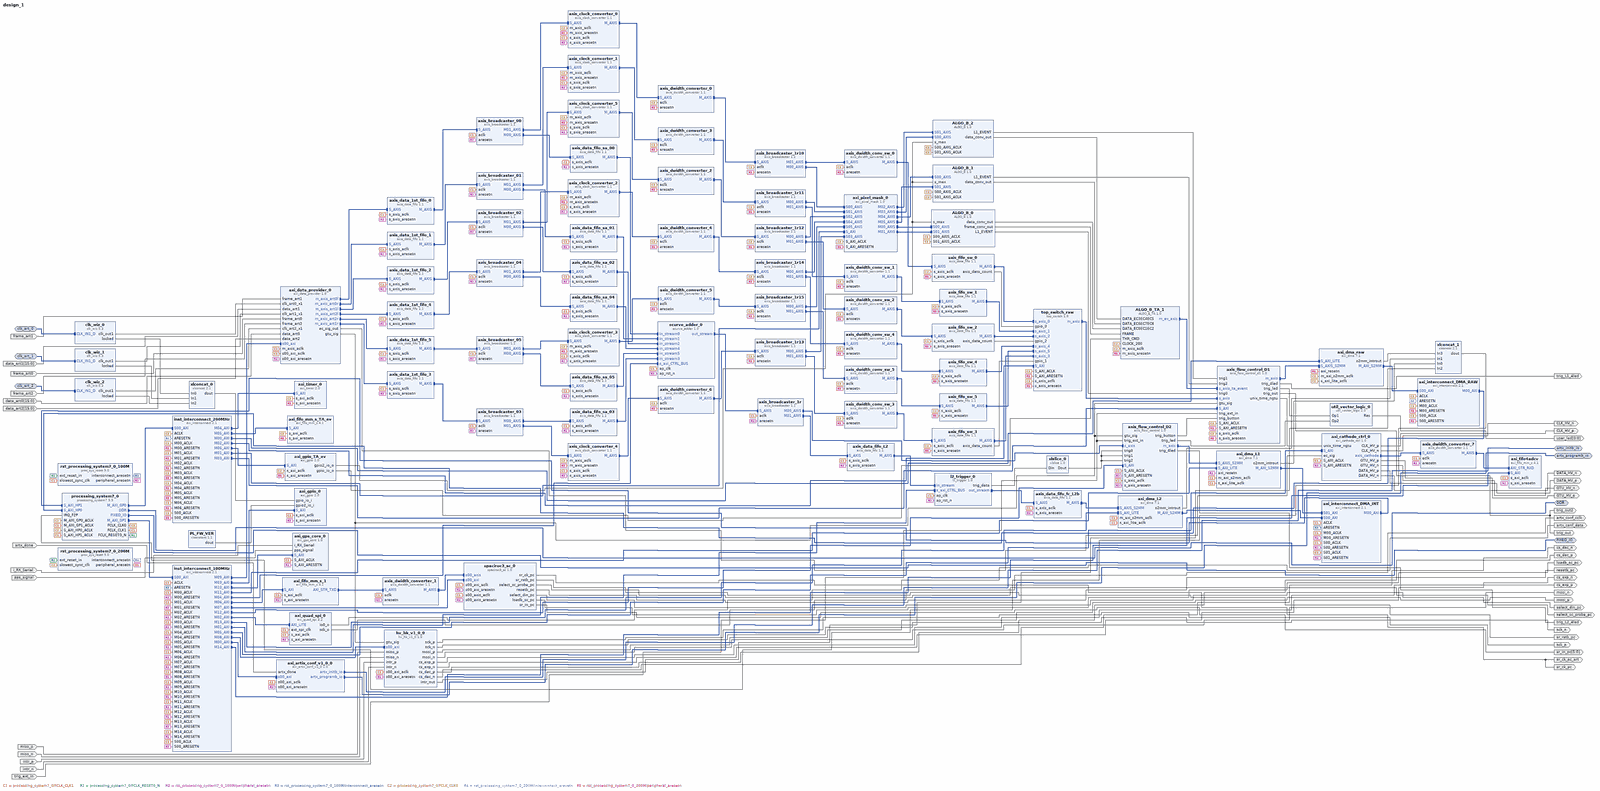
[diagram p0: block diagram of the top level, whole]
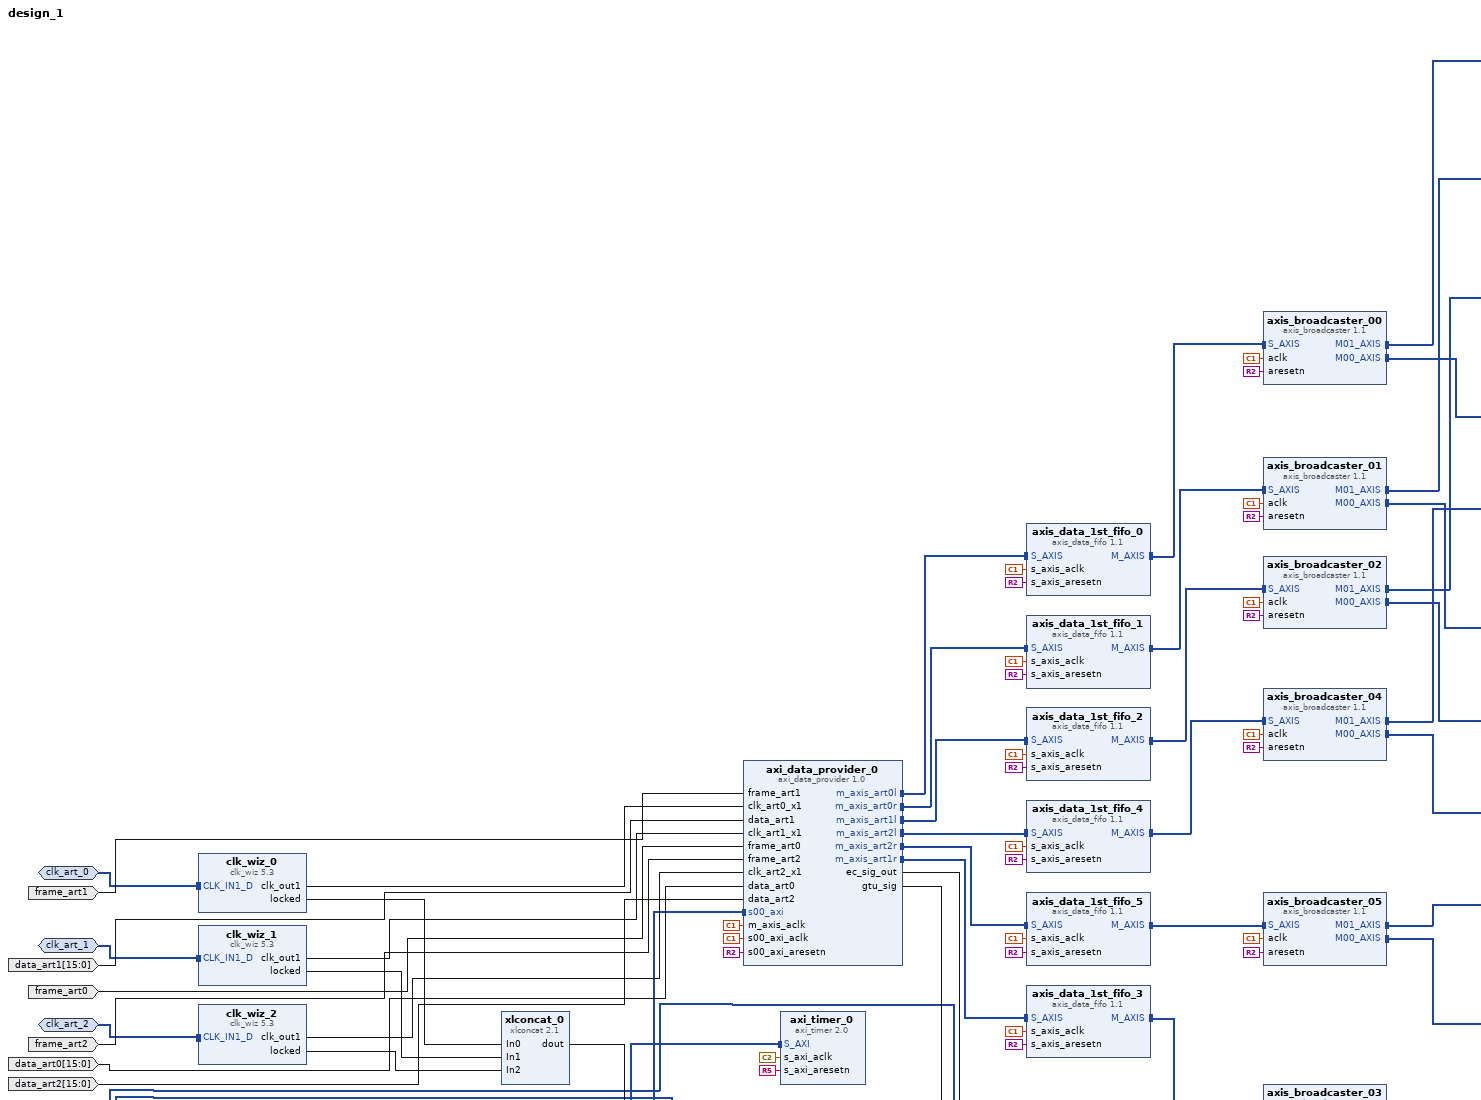
[diagram p1: block diagram of the top level, upper left part]
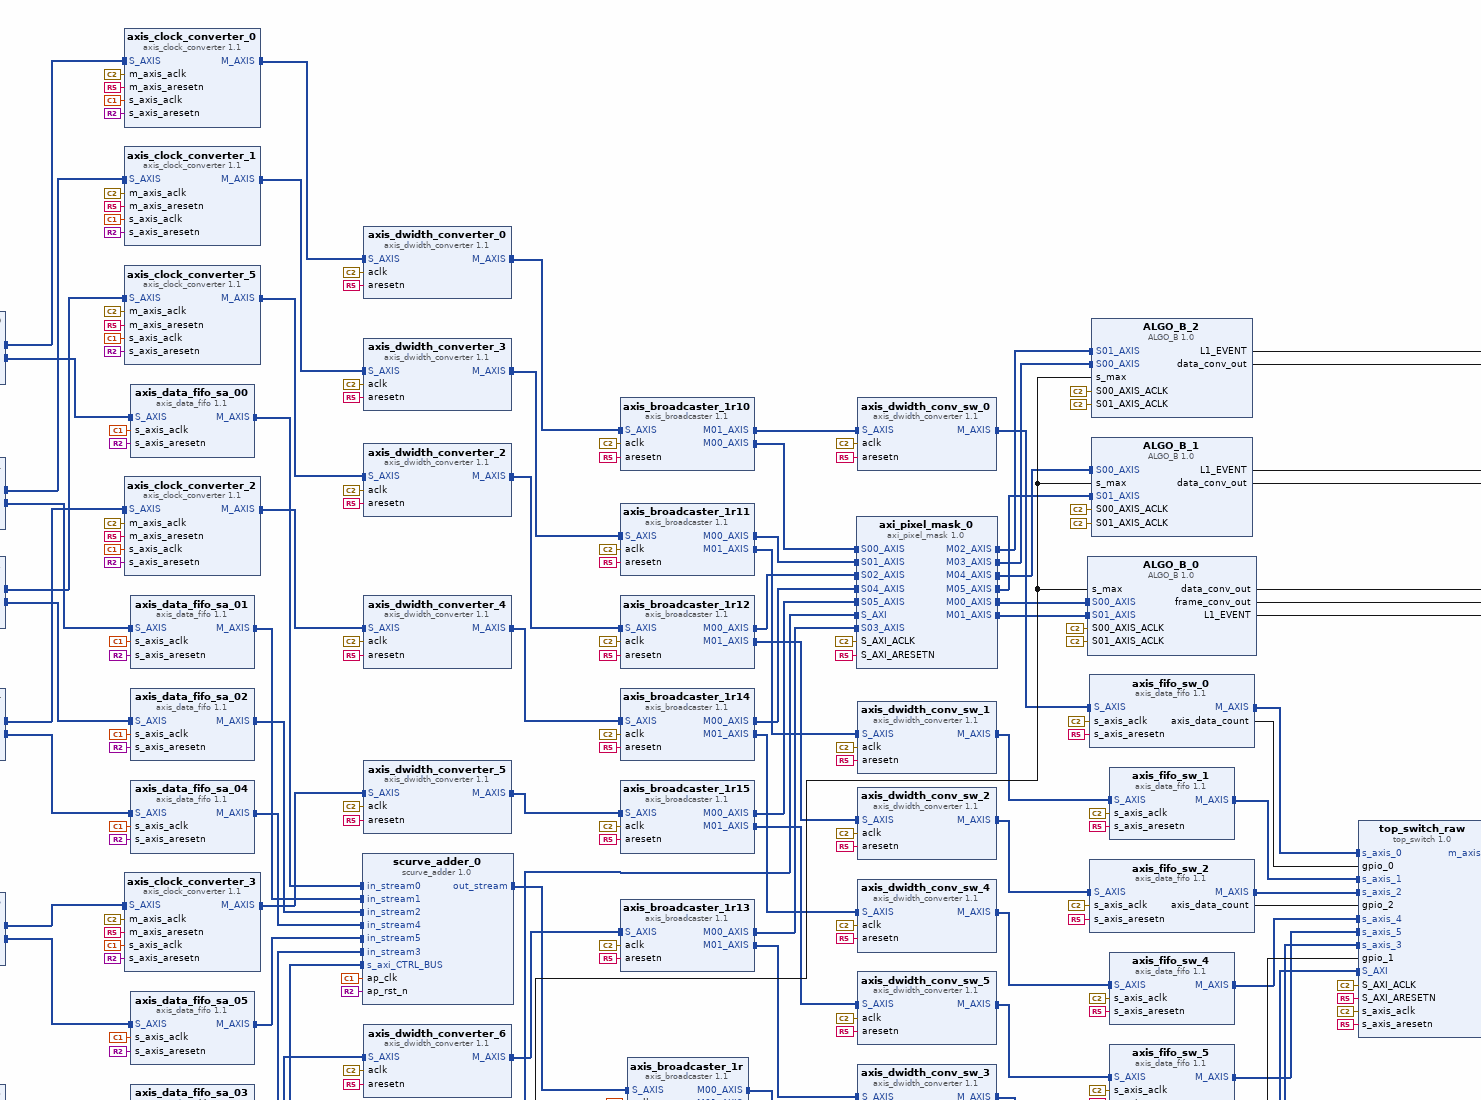
[diagram p2: block diagram of the top level, upper centre part]
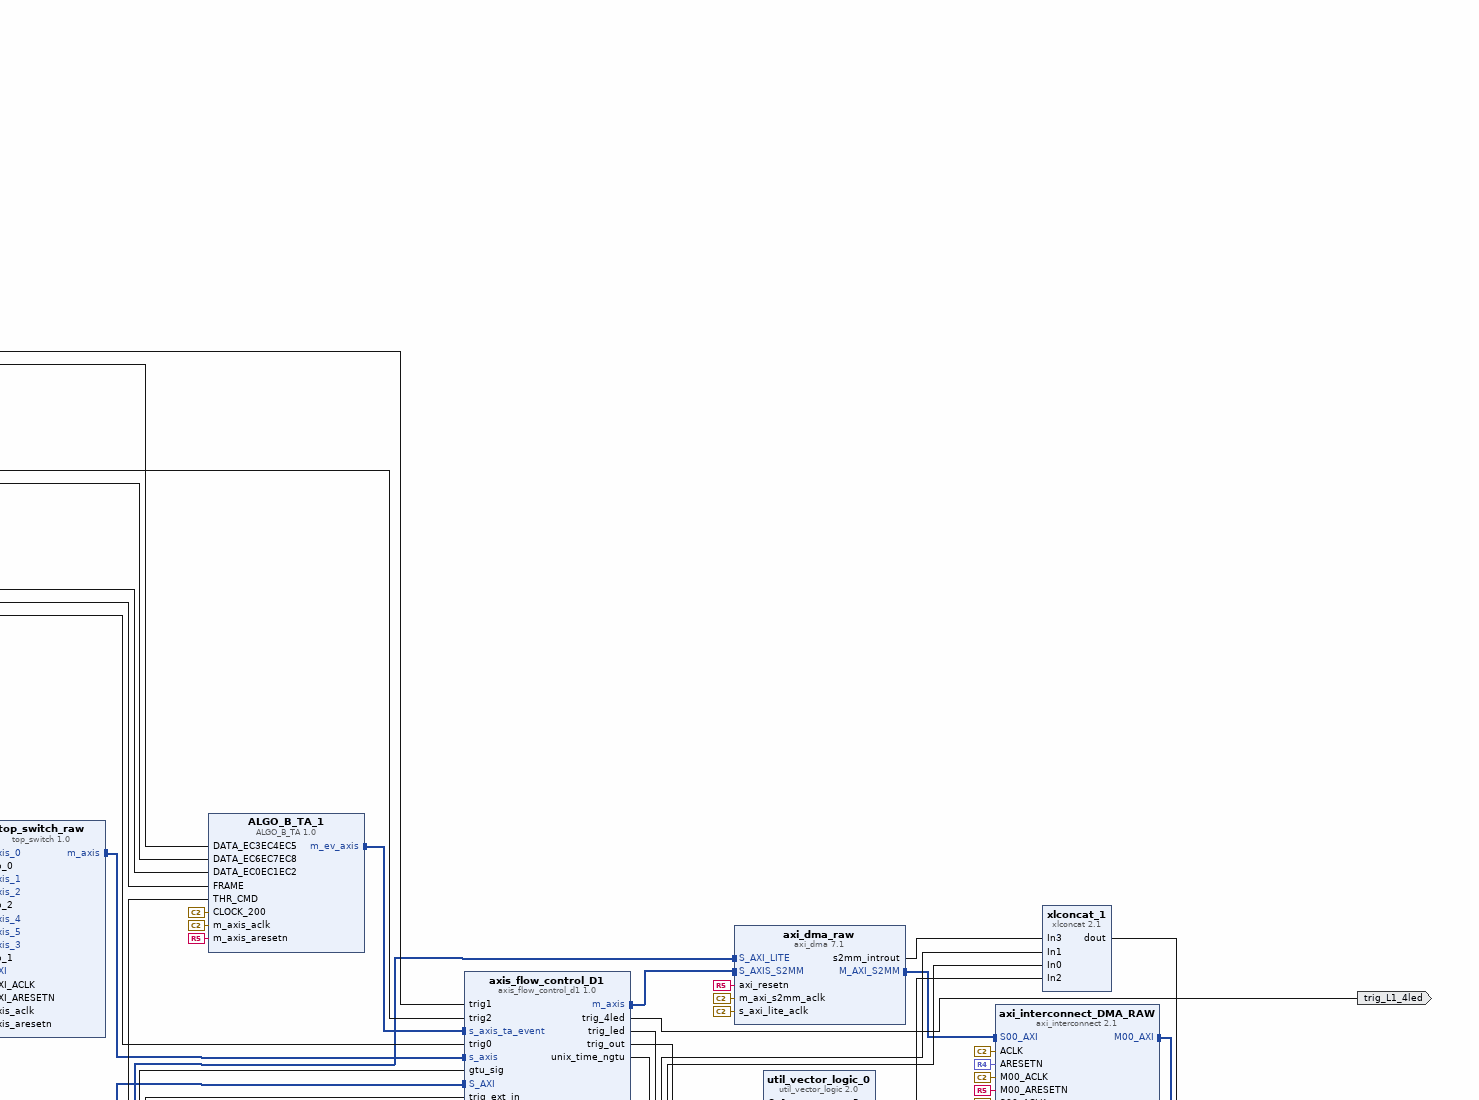
[diagram p3: block diagram of the top level, upper right part]
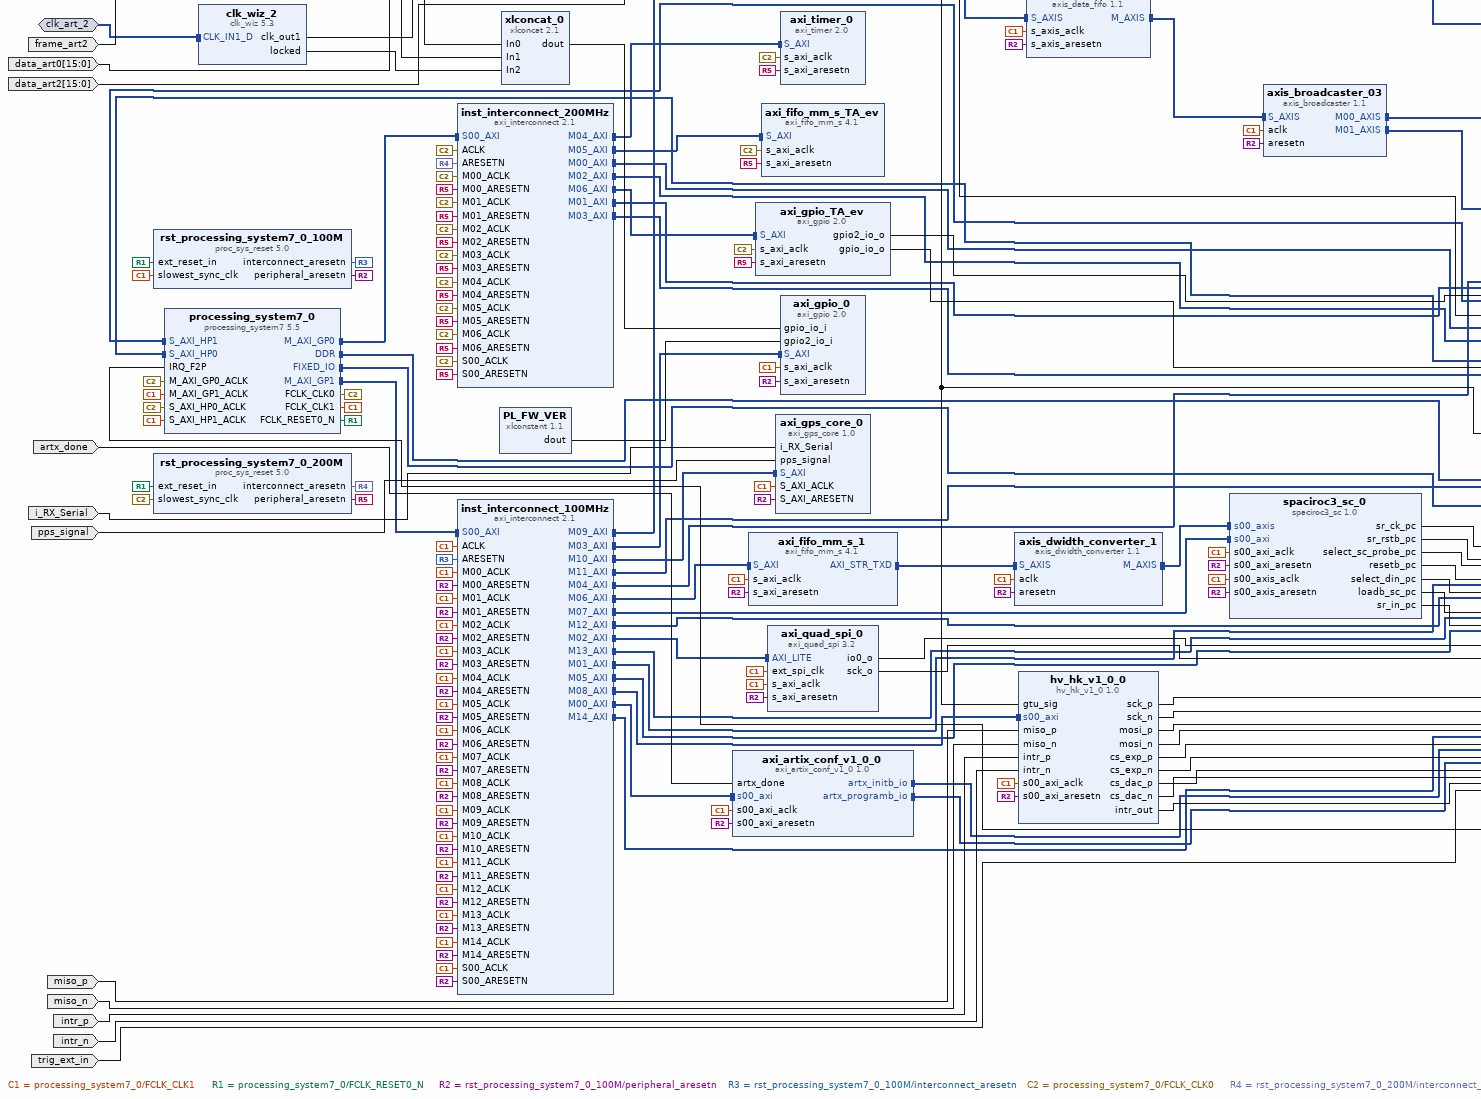
[diagram p4: block diagram of the top level, lower left part]
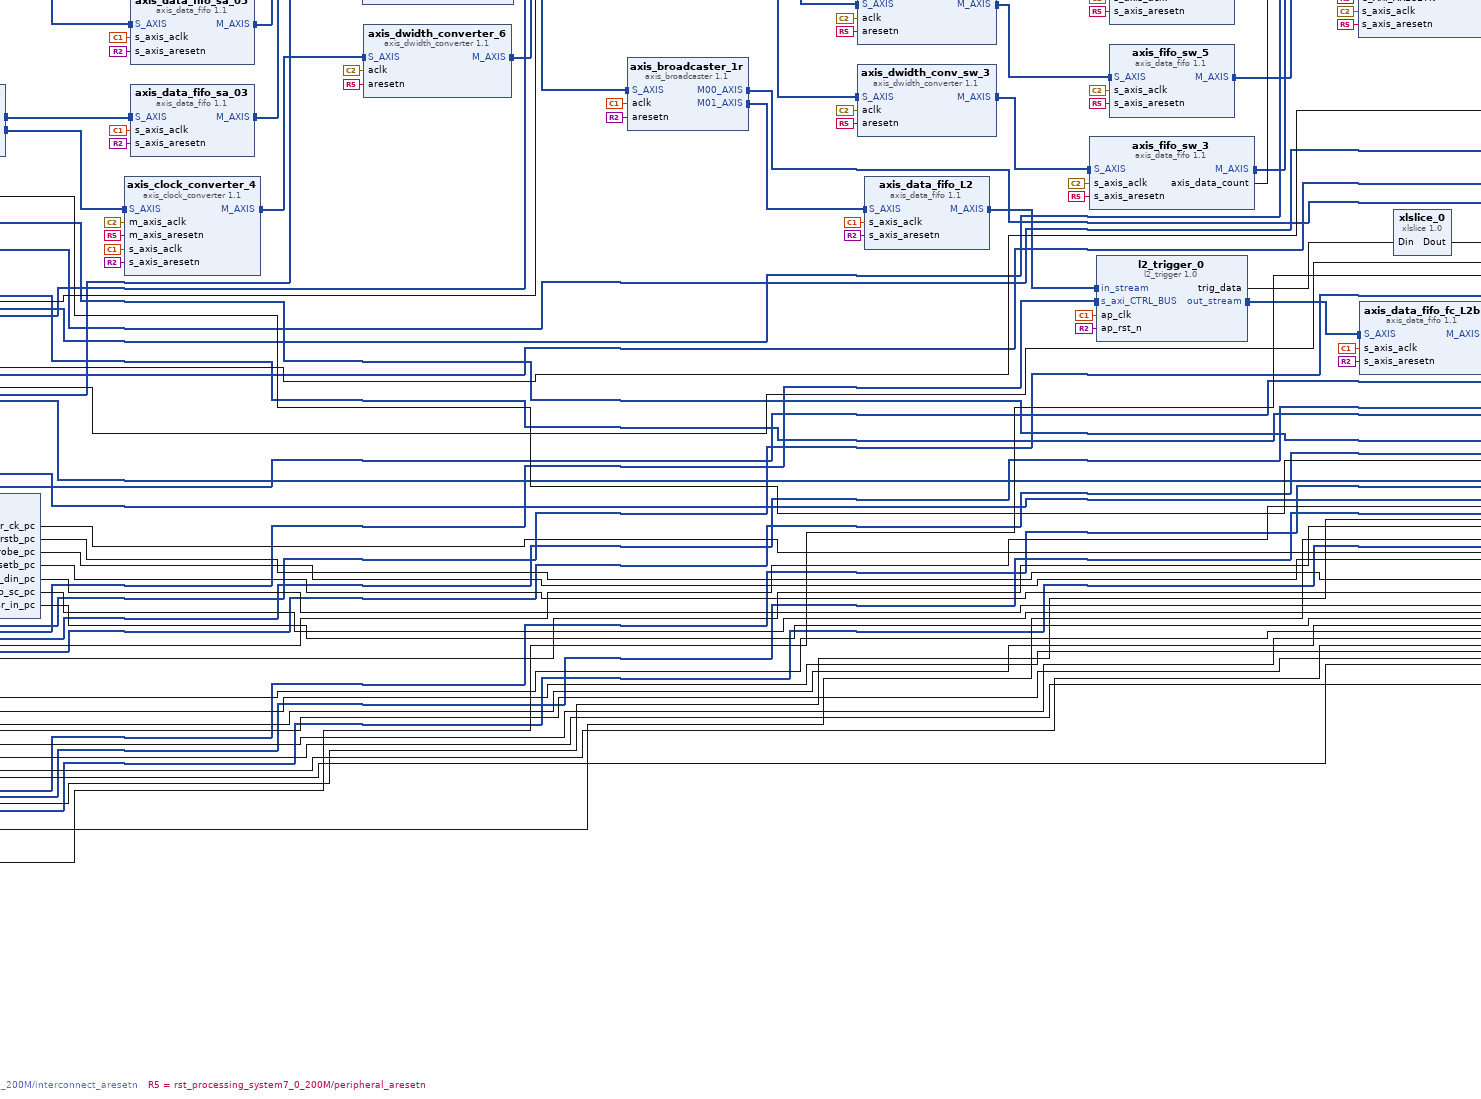
[diagram p5: block diagram of the top level, lower centre part]
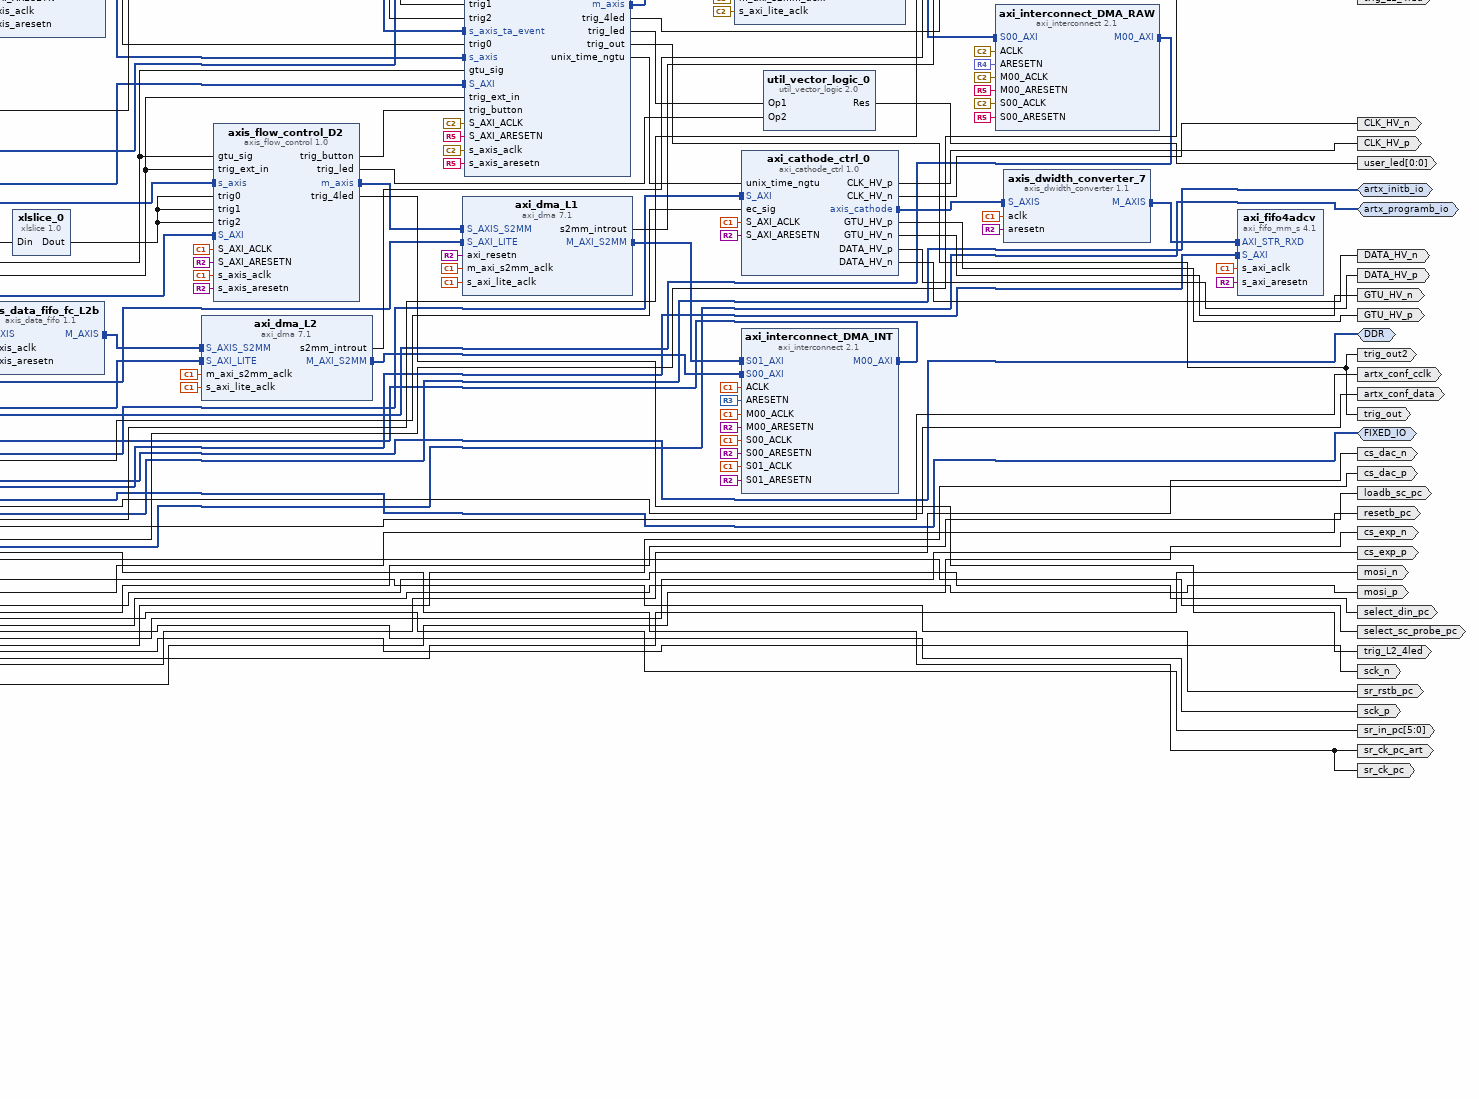
[diagram p6: block diagram of the top level, lower right part]
# Vivado block design design_1, Vivado 2016.2
create_bd_design design_1

create_bd_intf_port -mode Master -vlnv xilinx.com:interface:ddrx_rtl:1.0 DDR
create_bd_intf_port -mode Master -vlnv xilinx.com:display_processing_system7:fixedio_rtl:1.0 FIXED_IO
create_bd_intf_port -mode Master -vlnv xilinx.com:interface:gpio_rtl:1.0 artx_initb_io
create_bd_intf_port -mode Master -vlnv xilinx.com:interface:gpio_rtl:1.0 artx_programb_io
create_bd_intf_port -mode Slave -vlnv xilinx.com:interface:diff_clock_rtl:1.0 clk_art_1
create_bd_intf_port -mode Slave -vlnv xilinx.com:interface:diff_clock_rtl:1.0 clk_art_0
create_bd_intf_port -mode Slave -vlnv xilinx.com:interface:diff_clock_rtl:1.0 clk_art_2
create_bd_port -dir I artx_done
create_bd_port -dir O artx_conf_data
create_bd_port -dir O artx_conf_cclk
create_bd_port -dir I frame_art1
create_bd_port -dir I -from 15 -to 0 data_art1
create_bd_port -dir O sr_ck_pc_art
create_bd_port -dir O sr_ck_pc
create_bd_port -dir O sr_rstb_pc
create_bd_port -dir O select_sc_probe_pc
create_bd_port -dir O resetb_pc
create_bd_port -dir O select_din_pc
create_bd_port -dir O loadb_sc_pc
create_bd_port -dir O -from 5 -to 0 sr_in_pc
create_bd_port -dir O sck_p
create_bd_port -dir O sck_n
create_bd_port -dir O mosi_p
create_bd_port -dir O mosi_n
create_bd_port -dir O cs_exp_p
create_bd_port -dir O cs_exp_n
create_bd_port -dir O cs_dac_p
create_bd_port -dir O cs_dac_n
create_bd_port -dir I miso_p
create_bd_port -dir I miso_n
create_bd_port -dir I intr_p
create_bd_port -dir I intr_n
create_bd_port -dir I frame_art0
create_bd_port -dir I frame_art2
create_bd_port -dir I -from 15 -to 0 data_art0
create_bd_port -dir I -from 15 -to 0 data_art2
create_bd_port -dir O -from 0 -to 0 user_led
create_bd_port -dir O trig_L2_4led
create_bd_port -dir I trig_ext_in
create_bd_port -dir O trig_L1_4led
create_bd_port -dir O trig_out2
create_bd_port -dir O trig_out
create_bd_port -dir I i_RX_Serial
create_bd_port -dir I pps_signal
create_bd_port -dir O GTU_HV_p
create_bd_port -dir O GTU_HV_n
create_bd_port -dir O CLK_HV_p
create_bd_port -dir O CLK_HV_n
create_bd_port -dir O DATA_HV_p
create_bd_port -dir O DATA_HV_n

create_bd_cell -type ip -vlnv xilinx.com:ip:processing_system7:5.5 processing_system7_0
set_property -dict [list \
  CONFIG.PCW_APU_PERIPHERAL_FREQMHZ 800 \
  CONFIG.PCW_FPGA0_PERIPHERAL_FREQMHZ 200 \
  CONFIG.PCW_FPGA1_PERIPHERAL_FREQMHZ 100 \
  CONFIG.PCW_USE_M_AXI_GP1 1 \
  CONFIG.PCW_USE_S_AXI_HP0 1 \
  CONFIG.PCW_USE_S_AXI_HP1 1 \
  CONFIG.PCW_USE_FABRIC_INTERRUPT 1 \
  CONFIG.PCW_EN_CLK1_PORT 1 \
  CONFIG.PCW_IRQ_F2P_INTR 1 \
  CONFIG.PCW_PRESET_BANK0_VOLTAGE {LVCMOS 1.8V} \
  CONFIG.PCW_PRESET_BANK1_VOLTAGE {LVCMOS 1.8V} \
  CONFIG.PCW_UIPARAM_DDR_PARTNO {MT41K256M16 RE-15E} \
  CONFIG.PCW_QSPI_PERIPHERAL_ENABLE 1 \
  CONFIG.PCW_ENET0_PERIPHERAL_ENABLE 1 \
  CONFIG.PCW_ENET0_ENET0_IO {MIO 16 .. 27} \
  CONFIG.PCW_ENET0_GRP_MDIO_ENABLE 1 \
  CONFIG.PCW_SD0_PERIPHERAL_ENABLE 1 \
  CONFIG.PCW_UART0_PERIPHERAL_ENABLE 1 \
  CONFIG.PCW_UART0_UART0_IO {MIO 50 .. 51} \
  CONFIG.PCW_UART1_PERIPHERAL_ENABLE 1 \
  CONFIG.PCW_UART1_UART1_IO {MIO 48 .. 49} \
] [get_bd_cells processing_system7_0]
# 4 more settings of processing_system7_0 are not shown: defaults, MIO pin electricals, DDR timing, and values the tool derives
create_bd_cell -type ip -vlnv xilinx.com:user:axi_artix_conf_v1_0:1.0 axi_artix_conf_v1_0_0
create_bd_cell -type ip -vlnv xilinx.com:ip:xlconcat:2.1 xlconcat_0
set_property -dict {CONFIG.NUM_PORTS 6 CONFIG.IN3_WIDTH 13 CONFIG.IN4_WIDTH 14 CONFIG.IN5_WIDTH 2} [get_bd_cells xlconcat_0]
create_bd_cell -type ip -vlnv xilinx.com:ip:axi_gpio:2.0 axi_gpio_0
set_property -dict [list \
  CONFIG.C_GPIO_WIDTH 32 \
  CONFIG.C_GPIO2_WIDTH 32 \
  CONFIG.C_IS_DUAL 1 \
  CONFIG.C_ALL_INPUTS 1 \
  CONFIG.C_ALL_INPUTS_2 1 \
] [get_bd_cells axi_gpio_0]
create_bd_cell -type ip -vlnv xilinx.com:ip:axi_quad_spi:3.2 axi_quad_spi_0
set_property -dict [list \
  CONFIG.C_USE_STARTUP 0 \
  CONFIG.C_SCK_RATIO 16 \
  CONFIG.C_FIFO_DEPTH 256 \
  CONFIG.C_XIP_MODE 0 \
  CONFIG.C_TYPE_OF_AXI4_INTERFACE 0 \
  CONFIG.Master_mode 1 \
  CONFIG.FIFO_INCLUDED 1 \
] [get_bd_cells axi_quad_spi_0]
create_bd_cell -type ip -vlnv xilinx.com:ip:axi_interconnect:2.1 inst_interconnect_100MHz
set_property -dict {CONFIG.NUM_MI 15} [get_bd_cells inst_interconnect_100MHz]
create_bd_cell -type ip -vlnv xilinx.com:ip:proc_sys_reset:5.0 rst_processing_system7_0_100M
create_bd_cell -type ip -vlnv xilinx.com:ip:axi_fifo_mm_s:4.1 axi_fifo_mm_s_1
set_property -dict [list \
  CONFIG.C_USE_TX_CUT_THROUGH 0 \
  CONFIG.C_TX_FIFO_PE_THRESHOLD 2 \
  CONFIG.C_TX_FIFO_PF_THRESHOLD 4091 \
  CONFIG.C_TX_FIFO_DEPTH 4096 \
  CONFIG.C_USE_RX_DATA 0 \
  CONFIG.C_USE_TX_CTRL 0 \
] [get_bd_cells axi_fifo_mm_s_1]
create_bd_cell -type ip -vlnv xilinx.com:ip:axis_dwidth_converter:1.1 axis_dwidth_converter_1
set_property -dict {CONFIG.S_TDATA_NUM_BYTES 4 CONFIG.M_TDATA_NUM_BYTES 24} [get_bd_cells axis_dwidth_converter_1]
create_bd_cell -type ip -vlnv user.org:user:spaciroc3_sc:1.0 spaciroc3_sc_0
create_bd_cell -type ip -vlnv xilinx.com:ip:clk_wiz:5.3 clk_wiz_0
set_property -dict [list \
  CONFIG.PRIMITIVE PLL \
  CONFIG.PRIM_SOURCE Differential_clock_capable_pin \
  CONFIG.CLKOUT1_DRIVES BUFG \
  CONFIG.CLKOUT2_DRIVES BUFG \
  CONFIG.CLKOUT3_DRIVES BUFG \
  CONFIG.CLKOUT4_DRIVES BUFG \
  CONFIG.CLKOUT5_DRIVES BUFG \
  CONFIG.CLKOUT6_DRIVES BUFG \
  CONFIG.CLKOUT7_DRIVES BUFG \
  CONFIG.USE_RESET false \
  CONFIG.MMCM_DIVCLK_DIVIDE 1 \
  CONFIG.MMCM_CLKFBOUT_MULT_F 9 \
  CONFIG.MMCM_COMPENSATION ZHOLD \
  CONFIG.MMCM_CLKOUT0_DIVIDE_F 9 \
  CONFIG.CLKOUT1_JITTER 137.681 \
  CONFIG.CLKOUT1_PHASE_ERROR 105.461 \
] [get_bd_cells clk_wiz_0]
create_bd_cell -type ip -vlnv xilinx.com:ip:clk_wiz:5.3 clk_wiz_2
set_property -dict {CONFIG.PRIM_SOURCE Differential_clock_capable_pin CONFIG.USE_RESET false} [get_bd_cells clk_wiz_2]
create_bd_cell -type ip -vlnv xilinx.com:ip:axi_interconnect:2.1 axi_interconnect_DMA_INT
set_property -dict {CONFIG.NUM_SI 2 CONFIG.NUM_MI 1} [get_bd_cells axi_interconnect_DMA_INT]
create_bd_cell -type ip -vlnv xilinx.com:ip:axi_interconnect:2.1 inst_interconnect_200MHz
set_property -dict {CONFIG.NUM_SI 1 CONFIG.NUM_MI 7} [get_bd_cells inst_interconnect_200MHz]
create_bd_cell -type ip -vlnv xilinx.com:ip:axi_dma:7.1 axi_dma_L1
set_property -dict {CONFIG.c_include_sg 0 CONFIG.c_sg_length_width 23 CONFIG.c_include_mm2s 0} [get_bd_cells axi_dma_L1]
create_bd_cell -type ip -vlnv xilinx.com:ip:axis_broadcaster:1.1 axis_broadcaster_1r
set_property -dict {CONFIG.HAS_TSTRB 0 CONFIG.HAS_TKEEP 0} [get_bd_cells axis_broadcaster_1r]
create_bd_cell -type ip -vlnv xilinx.com:ip:axis_data_fifo:1.1 axis_data_fifo_L2
set_property -dict [list \
  CONFIG.FIFO_DEPTH 2048 \
  CONFIG.FIFO_MODE 2 \
  CONFIG.HAS_TSTRB 0 \
  CONFIG.HAS_TKEEP 0 \
] [get_bd_cells axis_data_fifo_L2]
create_bd_cell -type ip -vlnv xilinx.com:ip:axis_data_fifo:1.1 axis_data_fifo_fc_L2b
set_property -dict [list \
  CONFIG.FIFO_DEPTH 2048 \
  CONFIG.FIFO_MODE 2 \
  CONFIG.HAS_TSTRB 0 \
  CONFIG.HAS_TKEEP 0 \
] [get_bd_cells axis_data_fifo_fc_L2b]
create_bd_cell -type ip -vlnv xilinx.com:hls:scurve_adder:1.0 scurve_adder_0
create_bd_cell -type ip -vlnv xilinx.com:ip:axi_dma:7.1 axi_dma_raw
set_property -dict [list \
  CONFIG.c_include_sg 0 \
  CONFIG.c_sg_length_width 19 \
  CONFIG.c_include_mm2s 0 \
  CONFIG.c_s2mm_burst_size 256 \
] [get_bd_cells axi_dma_raw]
create_bd_cell -type ip -vlnv xilinx.com:ip:axi_dma:7.1 axi_dma_L2
set_property -dict {CONFIG.c_include_sg 0 CONFIG.c_sg_length_width 23 CONFIG.c_include_mm2s 0} [get_bd_cells axi_dma_L2]
create_bd_cell -type ip -vlnv xilinx.com:ip:axis_broadcaster:1.1 axis_broadcaster_00
set_property -dict {CONFIG.HAS_TSTRB 0 CONFIG.HAS_TKEEP 0} [get_bd_cells axis_broadcaster_00]
create_bd_cell -type ip -vlnv xilinx.com:ip:axis_broadcaster:1.1 axis_broadcaster_02
set_property -dict {CONFIG.HAS_TSTRB 0 CONFIG.HAS_TKEEP 0} [get_bd_cells axis_broadcaster_02]
create_bd_cell -type ip -vlnv xilinx.com:ip:axis_broadcaster:1.1 axis_broadcaster_05
set_property -dict {CONFIG.HAS_TSTRB 0 CONFIG.HAS_TKEEP 0} [get_bd_cells axis_broadcaster_05]
create_bd_cell -type ip -vlnv xilinx.com:ip:axis_broadcaster:1.1 axis_broadcaster_04
set_property -dict {CONFIG.HAS_TSTRB 0 CONFIG.HAS_TKEEP 0} [get_bd_cells axis_broadcaster_04]
create_bd_cell -type ip -vlnv xilinx.com:ip:axis_broadcaster:1.1 axis_broadcaster_03
set_property -dict {CONFIG.HAS_TSTRB 0 CONFIG.HAS_TKEEP 0} [get_bd_cells axis_broadcaster_03]
create_bd_cell -type ip -vlnv xilinx.com:ip:axis_broadcaster:1.1 axis_broadcaster_01
set_property -dict {CONFIG.HAS_TSTRB 0 CONFIG.HAS_TKEEP 0} [get_bd_cells axis_broadcaster_01]
create_bd_cell -type ip -vlnv xilinx.com:ip:axis_data_fifo:1.1 axis_data_fifo_sa_04
set_property -dict {CONFIG.FIFO_DEPTH 2048 CONFIG.FIFO_MODE 2} [get_bd_cells axis_data_fifo_sa_04]
create_bd_cell -type ip -vlnv xilinx.com:ip:axis_data_fifo:1.1 axis_data_fifo_sa_03
set_property -dict {CONFIG.FIFO_DEPTH 2048 CONFIG.FIFO_MODE 2} [get_bd_cells axis_data_fifo_sa_03]
create_bd_cell -type ip -vlnv xilinx.com:ip:axis_data_fifo:1.1 axis_data_fifo_sa_01
set_property -dict {CONFIG.FIFO_DEPTH 2048 CONFIG.FIFO_MODE 2} [get_bd_cells axis_data_fifo_sa_01]
create_bd_cell -type ip -vlnv xilinx.com:ip:axis_data_fifo:1.1 axis_data_fifo_sa_00
set_property -dict {CONFIG.FIFO_DEPTH 2048 CONFIG.FIFO_MODE 2} [get_bd_cells axis_data_fifo_sa_00]
create_bd_cell -type ip -vlnv xilinx.com:ip:axis_data_fifo:1.1 axis_data_fifo_sa_02
set_property -dict {CONFIG.FIFO_DEPTH 2048 CONFIG.FIFO_MODE 2} [get_bd_cells axis_data_fifo_sa_02]
create_bd_cell -type ip -vlnv xilinx.com:ip:axis_data_fifo:1.1 axis_data_fifo_sa_05
set_property -dict {CONFIG.FIFO_DEPTH 2048 CONFIG.FIFO_MODE 2} [get_bd_cells axis_data_fifo_sa_05]
create_bd_cell -type ip -vlnv xilinx.com:ip:axis_clock_converter:1.1 axis_clock_converter_0
set_property -dict {CONFIG.HAS_TKEEP 0} [get_bd_cells axis_clock_converter_0]
create_bd_cell -type ip -vlnv xilinx.com:ip:axis_clock_converter:1.1 axis_clock_converter_1
set_property -dict {CONFIG.HAS_TSTRB 0 CONFIG.HAS_TKEEP 0} [get_bd_cells axis_clock_converter_1]
create_bd_cell -type ip -vlnv xilinx.com:ip:axis_clock_converter:1.1 axis_clock_converter_2
set_property -dict {CONFIG.HAS_TSTRB 0 CONFIG.HAS_TKEEP 0} [get_bd_cells axis_clock_converter_2]
create_bd_cell -type ip -vlnv xilinx.com:ip:axis_clock_converter:1.1 axis_clock_converter_3
set_property -dict {CONFIG.HAS_TSTRB 0 CONFIG.HAS_TKEEP 0} [get_bd_cells axis_clock_converter_3]
create_bd_cell -type ip -vlnv xilinx.com:ip:axis_clock_converter:1.1 axis_clock_converter_4
set_property -dict {CONFIG.HAS_TSTRB 0 CONFIG.HAS_TKEEP 0} [get_bd_cells axis_clock_converter_4]
create_bd_cell -type ip -vlnv xilinx.com:ip:axis_clock_converter:1.1 axis_clock_converter_5
set_property -dict {CONFIG.HAS_TSTRB 0 CONFIG.HAS_TKEEP 0} [get_bd_cells axis_clock_converter_5]
create_bd_cell -type ip -vlnv xilinx.com:ip:axis_dwidth_converter:1.1 axis_dwidth_converter_0
set_property -dict [list \
  CONFIG.S_TDATA_NUM_BYTES 2 \
  CONFIG.M_TDATA_NUM_BYTES 1 \
  CONFIG.HAS_TSTRB 0 \
  CONFIG.HAS_TKEEP 0 \
] [get_bd_cells axis_dwidth_converter_0]
create_bd_cell -type ip -vlnv xilinx.com:ip:axis_dwidth_converter:1.1 axis_dwidth_converter_2
set_property -dict [list \
  CONFIG.S_TDATA_NUM_BYTES 2 \
  CONFIG.M_TDATA_NUM_BYTES 1 \
  CONFIG.HAS_TSTRB 0 \
  CONFIG.HAS_TKEEP 0 \
] [get_bd_cells axis_dwidth_converter_2]
create_bd_cell -type ip -vlnv xilinx.com:ip:axis_dwidth_converter:1.1 axis_dwidth_converter_3
set_property -dict [list \
  CONFIG.S_TDATA_NUM_BYTES 2 \
  CONFIG.M_TDATA_NUM_BYTES 1 \
  CONFIG.HAS_TSTRB 0 \
  CONFIG.HAS_TKEEP 0 \
] [get_bd_cells axis_dwidth_converter_3]
create_bd_cell -type ip -vlnv xilinx.com:ip:axis_dwidth_converter:1.1 axis_dwidth_converter_4
set_property -dict [list \
  CONFIG.S_TDATA_NUM_BYTES 2 \
  CONFIG.M_TDATA_NUM_BYTES 1 \
  CONFIG.HAS_TSTRB 0 \
  CONFIG.HAS_TKEEP 0 \
  CONFIG.HAS_MI_TKEEP 0 \
] [get_bd_cells axis_dwidth_converter_4]
create_bd_cell -type ip -vlnv xilinx.com:ip:axis_dwidth_converter:1.1 axis_dwidth_converter_5
set_property -dict [list \
  CONFIG.S_TDATA_NUM_BYTES 2 \
  CONFIG.M_TDATA_NUM_BYTES 1 \
  CONFIG.HAS_TSTRB 0 \
  CONFIG.HAS_TKEEP 0 \
  CONFIG.HAS_MI_TKEEP 0 \
] [get_bd_cells axis_dwidth_converter_5]
create_bd_cell -type ip -vlnv xilinx.com:ip:axis_dwidth_converter:1.1 axis_dwidth_converter_6
set_property -dict [list \
  CONFIG.S_TDATA_NUM_BYTES 2 \
  CONFIG.M_TDATA_NUM_BYTES 1 \
  CONFIG.HAS_TSTRB 0 \
  CONFIG.HAS_TKEEP 0 \
  CONFIG.HAS_MI_TKEEP 0 \
] [get_bd_cells axis_dwidth_converter_6]
create_bd_cell -type ip -vlnv xilinx.com:ip:axi_interconnect:2.1 axi_interconnect_DMA_RAW
set_property -dict {CONFIG.NUM_SI 1 CONFIG.NUM_MI 1} [get_bd_cells axi_interconnect_DMA_RAW]
create_bd_cell -type ip -vlnv xilinx.com:ip:axis_dwidth_converter:1.1 axis_dwidth_conv_sw_0
set_property -dict {CONFIG.M_TDATA_NUM_BYTES 8 CONFIG.HAS_TSTRB 0 CONFIG.HAS_TKEEP 0} [get_bd_cells axis_dwidth_conv_sw_0]
create_bd_cell -type ip -vlnv xilinx.com:ip:axis_dwidth_converter:1.1 axis_dwidth_conv_sw_2
set_property -dict {CONFIG.M_TDATA_NUM_BYTES 8 CONFIG.HAS_TSTRB 0 CONFIG.HAS_TKEEP 0} [get_bd_cells axis_dwidth_conv_sw_2]
create_bd_cell -type ip -vlnv xilinx.com:ip:axis_dwidth_converter:1.1 axis_dwidth_conv_sw_4
set_property -dict {CONFIG.M_TDATA_NUM_BYTES 8 CONFIG.HAS_TSTRB 0 CONFIG.HAS_TKEEP 0} [get_bd_cells axis_dwidth_conv_sw_4]
create_bd_cell -type ip -vlnv xilinx.com:ip:axis_data_fifo:1.1 axis_fifo_sw_0
set_property -dict {CONFIG.FIFO_DEPTH 512 CONFIG.FIFO_MODE 2 CONFIG.HAS_TKEEP 0} [get_bd_cells axis_fifo_sw_0]
create_bd_cell -type ip -vlnv xilinx.com:ip:axis_data_fifo:1.1 axis_fifo_sw_2
set_property -dict {CONFIG.FIFO_DEPTH 512 CONFIG.FIFO_MODE 2 CONFIG.HAS_TKEEP 0} [get_bd_cells axis_fifo_sw_2]
create_bd_cell -type ip -vlnv xilinx.com:ip:axis_data_fifo:1.1 axis_fifo_sw_3
set_property -dict {CONFIG.FIFO_DEPTH 512 CONFIG.FIFO_MODE 2 CONFIG.HAS_TKEEP 0} [get_bd_cells axis_fifo_sw_3]
create_bd_cell -type ip -vlnv xilinx.com:ip:xlslice:1.0 xlslice_0
create_bd_cell -type ip -vlnv xilinx.com:ip:clk_wiz:5.3 clk_wiz_1
set_property -dict {CONFIG.PRIM_SOURCE Differential_clock_capable_pin CONFIG.USE_RESET false} [get_bd_cells clk_wiz_1]
create_bd_cell -type ip -vlnv xilinx.com:ip:proc_sys_reset:5.0 rst_processing_system7_0_200M
create_bd_cell -type ip -vlnv xilinx.com:ip:axis_broadcaster:1.1 axis_broadcaster_1r10
set_property -dict {CONFIG.HAS_TSTRB 0 CONFIG.HAS_TKEEP 0} [get_bd_cells axis_broadcaster_1r10]
create_bd_cell -type ip -vlnv xilinx.com:ip:axis_broadcaster:1.1 axis_broadcaster_1r11
set_property -dict {CONFIG.HAS_TSTRB 0 CONFIG.HAS_TKEEP 0} [get_bd_cells axis_broadcaster_1r11]
create_bd_cell -type ip -vlnv xilinx.com:ip:axis_broadcaster:1.1 axis_broadcaster_1r12
set_property -dict {CONFIG.HAS_TSTRB 0 CONFIG.HAS_TKEEP 0} [get_bd_cells axis_broadcaster_1r12]
create_bd_cell -type ip -vlnv xilinx.com:ip:axis_broadcaster:1.1 axis_broadcaster_1r13
set_property -dict {CONFIG.HAS_TSTRB 0 CONFIG.HAS_TKEEP 0} [get_bd_cells axis_broadcaster_1r13]
create_bd_cell -type ip -vlnv xilinx.com:ip:axis_broadcaster:1.1 axis_broadcaster_1r14
set_property -dict {CONFIG.HAS_TSTRB 0 CONFIG.HAS_TKEEP 0} [get_bd_cells axis_broadcaster_1r14]
create_bd_cell -type ip -vlnv xilinx.com:ip:axis_broadcaster:1.1 axis_broadcaster_1r15
set_property -dict {CONFIG.HAS_TSTRB 0 CONFIG.HAS_TKEEP 0} [get_bd_cells axis_broadcaster_1r15]
create_bd_cell -type ip -vlnv xilinx.com:ip:axis_dwidth_converter:1.1 axis_dwidth_conv_sw_1
set_property -dict {CONFIG.M_TDATA_NUM_BYTES 8 CONFIG.HAS_TSTRB 0 CONFIG.HAS_TKEEP 0} [get_bd_cells axis_dwidth_conv_sw_1]
create_bd_cell -type ip -vlnv xilinx.com:ip:axis_dwidth_converter:1.1 axis_dwidth_conv_sw_3
set_property -dict {CONFIG.M_TDATA_NUM_BYTES 8 CONFIG.HAS_TSTRB 0 CONFIG.HAS_TKEEP 0} [get_bd_cells axis_dwidth_conv_sw_3]
create_bd_cell -type ip -vlnv xilinx.com:ip:axis_dwidth_converter:1.1 axis_dwidth_conv_sw_5
set_property -dict {CONFIG.M_TDATA_NUM_BYTES 8 CONFIG.HAS_TSTRB 0 CONFIG.HAS_TKEEP 0} [get_bd_cells axis_dwidth_conv_sw_5]
create_bd_cell -type ip -vlnv xilinx.com:ip:axis_data_fifo:1.1 axis_fifo_sw_1
set_property -dict {CONFIG.FIFO_DEPTH 512 CONFIG.FIFO_MODE 2 CONFIG.HAS_TKEEP 0} [get_bd_cells axis_fifo_sw_1]
create_bd_cell -type ip -vlnv xilinx.com:ip:axis_data_fifo:1.1 axis_fifo_sw_4
set_property -dict {CONFIG.FIFO_DEPTH 512 CONFIG.FIFO_MODE 2 CONFIG.HAS_TKEEP 0} [get_bd_cells axis_fifo_sw_4]
create_bd_cell -type ip -vlnv xilinx.com:ip:axis_data_fifo:1.1 axis_fifo_sw_5
set_property -dict {CONFIG.FIFO_DEPTH 512 CONFIG.FIFO_MODE 2 CONFIG.HAS_TKEEP 0} [get_bd_cells axis_fifo_sw_5]
create_bd_cell -type ip -vlnv xilinx.com:ip:xlconcat:2.1 xlconcat_1
set_property -dict {CONFIG.NUM_PORTS 4} [get_bd_cells xlconcat_1]
create_bd_cell -type ip -vlnv xilinx.com:ip:util_vector_logic:2.0 util_vector_logic_0
set_property -dict {CONFIG.C_SIZE 1 CONFIG.C_OPERATION or} [get_bd_cells util_vector_logic_0]
create_bd_cell -type ip -vlnv xilinx.com:ip:axis_data_fifo:1.1 axis_data_1st_fifo_0
set_property -dict [list \
  CONFIG.TID_WIDTH 0 \
  CONFIG.TDEST_WIDTH 0 \
  CONFIG.TUSER_WIDTH 0 \
  CONFIG.FIFO_DEPTH 512 \
  CONFIG.HAS_TSTRB 0 \
  CONFIG.HAS_TKEEP 0 \
  CONFIG.HAS_TLAST 1 \
] [get_bd_cells axis_data_1st_fifo_0]
create_bd_cell -type ip -vlnv xilinx.com:ip:axis_data_fifo:1.1 axis_data_1st_fifo_1
set_property -dict [list \
  CONFIG.TID_WIDTH 0 \
  CONFIG.TDEST_WIDTH 0 \
  CONFIG.TUSER_WIDTH 0 \
  CONFIG.FIFO_DEPTH 512 \
  CONFIG.HAS_TSTRB 0 \
  CONFIG.HAS_TKEEP 0 \
  CONFIG.HAS_TLAST 1 \
] [get_bd_cells axis_data_1st_fifo_1]
create_bd_cell -type ip -vlnv xilinx.com:ip:axis_data_fifo:1.1 axis_data_1st_fifo_2
set_property -dict [list \
  CONFIG.TID_WIDTH 0 \
  CONFIG.TDEST_WIDTH 0 \
  CONFIG.TUSER_WIDTH 0 \
  CONFIG.FIFO_DEPTH 512 \
  CONFIG.HAS_TSTRB 0 \
  CONFIG.HAS_TKEEP 0 \
  CONFIG.HAS_TLAST 1 \
] [get_bd_cells axis_data_1st_fifo_2]
create_bd_cell -type ip -vlnv xilinx.com:ip:axis_data_fifo:1.1 axis_data_1st_fifo_3
set_property -dict [list \
  CONFIG.TID_WIDTH 0 \
  CONFIG.TDEST_WIDTH 0 \
  CONFIG.TUSER_WIDTH 0 \
  CONFIG.FIFO_DEPTH 512 \
  CONFIG.HAS_TSTRB 0 \
  CONFIG.HAS_TKEEP 0 \
  CONFIG.HAS_TLAST 1 \
] [get_bd_cells axis_data_1st_fifo_3]
create_bd_cell -type ip -vlnv xilinx.com:ip:axis_data_fifo:1.1 axis_data_1st_fifo_4
set_property -dict [list \
  CONFIG.TID_WIDTH 0 \
  CONFIG.TDEST_WIDTH 0 \
  CONFIG.TUSER_WIDTH 0 \
  CONFIG.FIFO_DEPTH 512 \
  CONFIG.HAS_TSTRB 0 \
  CONFIG.HAS_TKEEP 0 \
  CONFIG.HAS_TLAST 1 \
] [get_bd_cells axis_data_1st_fifo_4]
create_bd_cell -type ip -vlnv xilinx.com:ip:axis_data_fifo:1.1 axis_data_1st_fifo_5
set_property -dict [list \
  CONFIG.TID_WIDTH 0 \
  CONFIG.TDEST_WIDTH 0 \
  CONFIG.TUSER_WIDTH 0 \
  CONFIG.FIFO_DEPTH 512 \
  CONFIG.HAS_TSTRB 0 \
  CONFIG.HAS_TKEEP 0 \
  CONFIG.HAS_TLAST 1 \
] [get_bd_cells axis_data_1st_fifo_5]
create_bd_cell -type ip -vlnv user.org:user:top_switch:1.0 top_switch_raw
set_property -dict {CONFIG.C_SHORT_SWITCH {"1"} CONFIG.C_AXIS_DWIDTH 64} [get_bd_cells top_switch_raw]
create_bd_cell -type ip -vlnv xilinx.com:hls:l2_trigger:1.0 l2_trigger_0
create_bd_cell -type ip -vlnv xilinx.com:ip:axi_fifo_mm_s:4.1 axi_fifo_mm_s_TA_ev
set_property -dict {CONFIG.C_USE_TX_DATA 0 CONFIG.C_USE_TX_CTRL 0} [get_bd_cells axi_fifo_mm_s_TA_ev]
create_bd_cell -type ip -vlnv xilinx.com:ip:axi_gpio:2.0 axi_gpio_TA_ev
set_property -dict [list \
  CONFIG.C_GPIO2_WIDTH 12 \
  CONFIG.C_IS_DUAL 1 \
  CONFIG.C_DOUT_DEFAULT_2 0x0000001C \
  CONFIG.C_ALL_OUTPUTS 1 \
  CONFIG.C_ALL_OUTPUTS_2 1 \
] [get_bd_cells axi_gpio_TA_ev]
create_bd_cell -type ip -vlnv xilinx.com:ip:xlconstant:1.1 PL_FW_VER
set_property -dict {CONFIG.CONST_WIDTH 32 CONFIG.CONST_VAL 20191114} [get_bd_cells PL_FW_VER]
create_bd_cell -type ip -vlnv xilinx.com:ip:axi_fifo_mm_s:4.1 axi_fifo4adcv
set_property -dict {CONFIG.C_USE_TX_DATA 0 CONFIG.C_USE_TX_CTRL 0} [get_bd_cells axi_fifo4adcv]
create_bd_cell -type ip -vlnv user.org:user:ALGO_B:1.0 ALGO_B_0
create_bd_cell -type ip -vlnv user.org:user:ALGO_B:1.0 ALGO_B_1
create_bd_cell -type ip -vlnv user.org:user:ALGO_B:1.0 ALGO_B_2
create_bd_cell -type ip -vlnv user.org:user:ALGO_B_TA:1.0 ALGO_B_TA_1
create_bd_cell -type ip -vlnv user.org:user:axi_data_provider:1.0 axi_data_provider_0
create_bd_cell -type ip -vlnv user.org:user:axi_gps_core:1.0 axi_gps_core_0
create_bd_cell -type ip -vlnv user.org:user:axi_pixel_mask:1.0 axi_pixel_mask_0
create_bd_cell -type ip -vlnv user.org:user:axis_flow_control:1.0 axis_flow_control_D2
set_property -dict {CONFIG.C_AXIS_DWIDTH 32 CONFIG.C_CNT_DWIDTH 32} [get_bd_cells axis_flow_control_D2]
create_bd_cell -type ip -vlnv user.org:user:hv_hk_v1_0:1.0 hv_hk_v1_0_0
set_property -dict {CONFIG.C_S00_AXI_ADDR_WIDTH 7} [get_bd_cells hv_hk_v1_0_0]
create_bd_cell -type ip -vlnv xilinx.com:ip:axi_timer:2.0 axi_timer_0
create_bd_cell -type ip -vlnv xilinx.com:ip:axis_dwidth_converter:1.1 axis_dwidth_converter_7
set_property -dict [list \
  CONFIG.S_TDATA_NUM_BYTES 16 \
  CONFIG.M_TDATA_NUM_BYTES 4 \
  CONFIG.TID_WIDTH 0 \
  CONFIG.TDEST_WIDTH 0 \
  CONFIG.TUSER_BITS_PER_BYTE 0 \
  CONFIG.HAS_TLAST 1 \
  CONFIG.HAS_TSTRB 0 \
  CONFIG.HAS_TKEEP 0 \
] [get_bd_cells axis_dwidth_converter_7]
create_bd_cell -type ip -vlnv user.org:user:axi_cathode_ctrl:1.0 axi_cathode_ctrl_0
create_bd_cell -type ip -vlnv user.org:user:axis_flow_control_d1:1.0 axis_flow_control_D1
set_property -dict {CONFIG.C_FREQ 200000000} [get_bd_cells axis_flow_control_D1]

# ---- connections ----

connect_bd_intf_net [get_bd_intf_pins inst_interconnect_100MHz/M02_AXI] [get_bd_intf_pins axi_quad_spi_0/AXI_LITE]
connect_bd_intf_net [get_bd_intf_pins inst_interconnect_100MHz/M00_AXI] [get_bd_intf_pins axi_artix_conf_v1_0_0/s00_axi]
connect_bd_intf_net [get_bd_intf_pins inst_interconnect_100MHz/M03_AXI] [get_bd_intf_pins axi_gpio_0/S_AXI]
connect_bd_intf_net [get_bd_intf_pins axi_fifo_mm_s_1/S_AXI] [get_bd_intf_pins inst_interconnect_100MHz/M06_AXI]
connect_bd_intf_net [get_bd_intf_pins axi_fifo_mm_s_1/AXI_STR_TXD] [get_bd_intf_pins axis_dwidth_converter_1/S_AXIS]
connect_bd_intf_net [get_bd_intf_pins axis_dwidth_converter_1/M_AXIS] [get_bd_intf_pins spaciroc3_sc_0/s00_axis]
connect_bd_intf_net [get_bd_intf_pins spaciroc3_sc_0/s00_axi] [get_bd_intf_pins inst_interconnect_100MHz/M07_AXI]
connect_bd_intf_net [get_bd_intf_pins hv_hk_v1_0_0/s00_axi] [get_bd_intf_pins inst_interconnect_100MHz/M08_AXI]
connect_bd_intf_net [get_bd_intf_pins inst_interconnect_100MHz/M09_AXI] [get_bd_intf_pins axi_data_provider_0/s00_axi]
connect_bd_intf_net [get_bd_intf_pins axi_interconnect_DMA_INT/S01_AXI] [get_bd_intf_pins axi_dma_L1/M_AXI_S2MM]
connect_bd_intf_net [get_bd_intf_pins scurve_adder_0/out_stream] [get_bd_intf_pins axis_broadcaster_1r/S_AXIS]
connect_bd_intf_net -intf_net dma_L2_S_AXIS [get_bd_intf_pins axis_data_fifo_fc_L2b/M_AXIS] [get_bd_intf_pins axi_dma_L2/S_AXIS_S2MM]
connect_bd_intf_net -intf_net axis_broadcaster_1r6_M00_AXIS [get_bd_intf_pins axis_broadcaster_01/M00_AXIS] [get_bd_intf_pins axis_data_fifo_sa_01/S_AXIS]
connect_bd_intf_net -intf_net axis_broadcaster_1r2_M00_AXIS [get_bd_intf_pins axis_broadcaster_02/M00_AXIS] [get_bd_intf_pins axis_data_fifo_sa_02/S_AXIS]
connect_bd_intf_net -intf_net axis_broadcaster_1r5_M00_AXIS [get_bd_intf_pins axis_broadcaster_03/M00_AXIS] [get_bd_intf_pins axis_data_fifo_sa_03/S_AXIS]
connect_bd_intf_net -intf_net axis_broadcaster_1r4_M00_AXIS [get_bd_intf_pins axis_broadcaster_04/M00_AXIS] [get_bd_intf_pins axis_data_fifo_sa_04/S_AXIS]
connect_bd_intf_net -intf_net axis_broadcaster_1r3_M00_AXIS [get_bd_intf_pins axis_broadcaster_05/M00_AXIS] [get_bd_intf_pins axis_data_fifo_sa_05/S_AXIS]
connect_bd_intf_net [get_bd_intf_pins axis_clock_converter_1/M_AXIS] [get_bd_intf_pins axis_dwidth_converter_3/S_AXIS]
connect_bd_intf_net [get_bd_intf_pins axis_clock_converter_5/M_AXIS] [get_bd_intf_pins axis_dwidth_converter_2/S_AXIS]
connect_bd_intf_net [get_bd_intf_pins axis_dwidth_converter_6/S_AXIS] [get_bd_intf_pins axis_clock_converter_4/M_AXIS]
connect_bd_intf_net [get_bd_intf_pins axis_dwidth_converter_4/S_AXIS] [get_bd_intf_pins axis_clock_converter_2/M_AXIS]
connect_bd_intf_net [get_bd_intf_pins axis_dwidth_converter_5/S_AXIS] [get_bd_intf_pins axis_clock_converter_3/M_AXIS]
connect_bd_intf_net [get_bd_intf_pins axi_dma_L1/S_AXI_LITE] [get_bd_intf_pins inst_interconnect_100MHz/M11_AXI]
connect_bd_intf_net [get_bd_intf_pins axi_dma_raw/S_AXI_LITE] [get_bd_intf_pins inst_interconnect_200MHz/M00_AXI]
connect_bd_intf_net [get_bd_intf_pins axi_dma_raw/M_AXI_S2MM] [get_bd_intf_pins axi_interconnect_DMA_RAW/S00_AXI]
connect_bd_intf_net -intf_net axi_interconnect_0_M00_AXI [get_bd_intf_pins axi_interconnect_DMA_INT/M00_AXI] [get_bd_intf_pins processing_system7_0/S_AXI_HP1]
connect_bd_intf_net -intf_net axi_interconnect_1_M00_AXI [get_bd_intf_pins axi_interconnect_DMA_RAW/M00_AXI] [get_bd_intf_pins processing_system7_0/S_AXI_HP0]
connect_bd_intf_net [get_bd_intf_pins inst_interconnect_200MHz/M02_AXI] [get_bd_intf_pins top_switch_raw/S_AXI]
connect_bd_intf_net -intf_net axis_dwidth_converter_7_M_AXIS [get_bd_intf_pins axis_dwidth_conv_sw_0/M_AXIS] [get_bd_intf_pins axis_fifo_sw_0/S_AXIS]
connect_bd_intf_net -intf_net axis_data_fifo_fc_L9_M_AXIS [get_bd_intf_pins axis_fifo_sw_0/M_AXIS] [get_bd_intf_pins top_switch_raw/s_axis_0]
connect_bd_intf_net [get_bd_intf_pins axis_broadcaster_1r/M00_AXIS] [get_bd_intf_pins axis_flow_control_D2/s_axis]
connect_bd_intf_net [get_bd_intf_pins axis_flow_control_D2/S_AXI] [get_bd_intf_pins inst_interconnect_100MHz/M12_AXI]
connect_bd_intf_net [get_bd_intf_pins axi_dma_L2/S_AXI_LITE] [get_bd_intf_pins inst_interconnect_100MHz/M13_AXI]
connect_bd_intf_net [get_bd_intf_pins processing_system7_0/M_AXI_GP0] [get_bd_intf_pins inst_interconnect_200MHz/S00_AXI]
connect_bd_intf_net [get_bd_intf_pins processing_system7_0/M_AXI_GP1] [get_bd_intf_pins inst_interconnect_100MHz/S00_AXI]
connect_bd_intf_net [get_bd_intf_pins axis_dwidth_converter_3/M_AXIS] [get_bd_intf_pins axis_broadcaster_1r11/S_AXIS]
connect_bd_intf_net [get_bd_intf_pins axis_dwidth_converter_2/M_AXIS] [get_bd_intf_pins axis_broadcaster_1r12/S_AXIS]
connect_bd_intf_net [get_bd_intf_pins axis_dwidth_converter_6/M_AXIS] [get_bd_intf_pins axis_broadcaster_1r13/S_AXIS]
connect_bd_intf_net [get_bd_intf_pins axis_dwidth_converter_4/M_AXIS] [get_bd_intf_pins axis_broadcaster_1r14/S_AXIS]
connect_bd_intf_net [get_bd_intf_pins axis_dwidth_converter_5/M_AXIS] [get_bd_intf_pins axis_broadcaster_1r15/S_AXIS]
connect_bd_intf_net -intf_net axis_data_fifo_fc_L12_M_AXIS [get_bd_intf_pins axis_fifo_sw_1/M_AXIS] [get_bd_intf_pins top_switch_raw/s_axis_1]
connect_bd_intf_net -intf_net axis_data_fifo_fc_L10_M_AXIS [get_bd_intf_pins axis_fifo_sw_2/M_AXIS] [get_bd_intf_pins top_switch_raw/s_axis_2]
connect_bd_intf_net -intf_net axis_data_fifo_fc_L11_M_AXIS [get_bd_intf_pins axis_fifo_sw_3/M_AXIS] [get_bd_intf_pins top_switch_raw/s_axis_3]
connect_bd_intf_net -intf_net axis_data_fifo_fc_L13_M_AXIS [get_bd_intf_pins axis_fifo_sw_4/M_AXIS] [get_bd_intf_pins top_switch_raw/s_axis_4]
connect_bd_intf_net -intf_net axis_data_fifo_fc_L14_M_AXIS [get_bd_intf_pins axis_fifo_sw_5/M_AXIS] [get_bd_intf_pins top_switch_raw/s_axis_5]
connect_bd_intf_net -intf_net axis_dwidth_converter_10_M_AXIS [get_bd_intf_pins axis_dwidth_conv_sw_1/M_AXIS] [get_bd_intf_pins axis_fifo_sw_1/S_AXIS]
connect_bd_intf_net -intf_net axis_dwidth_converter_8_M_AXIS [get_bd_intf_pins axis_dwidth_conv_sw_2/M_AXIS] [get_bd_intf_pins axis_fifo_sw_2/S_AXIS]
connect_bd_intf_net -intf_net axis_dwidth_converter_11_M_AXIS [get_bd_intf_pins axis_dwidth_conv_sw_3/M_AXIS] [get_bd_intf_pins axis_fifo_sw_3/S_AXIS]
connect_bd_intf_net -intf_net axis_dwidth_converter_9_M_AXIS [get_bd_intf_pins axis_dwidth_conv_sw_4/M_AXIS] [get_bd_intf_pins axis_fifo_sw_4/S_AXIS]
connect_bd_intf_net -intf_net axis_dwidth_converter_12_M_AXIS [get_bd_intf_pins axis_dwidth_conv_sw_5/M_AXIS] [get_bd_intf_pins axis_fifo_sw_5/S_AXIS]
connect_bd_intf_net [get_bd_intf_pins axis_broadcaster_1r10/M01_AXIS] [get_bd_intf_pins axis_dwidth_conv_sw_0/S_AXIS]
connect_bd_intf_net [get_bd_intf_pins axis_broadcaster_1r11/M01_AXIS] [get_bd_intf_pins axis_dwidth_conv_sw_1/S_AXIS]
connect_bd_intf_net [get_bd_intf_pins axis_broadcaster_1r12/M01_AXIS] [get_bd_intf_pins axis_dwidth_conv_sw_2/S_AXIS]
connect_bd_intf_net [get_bd_intf_pins axis_broadcaster_1r13/M01_AXIS] [get_bd_intf_pins axis_dwidth_conv_sw_3/S_AXIS]
connect_bd_intf_net [get_bd_intf_pins axis_broadcaster_1r14/M01_AXIS] [get_bd_intf_pins axis_dwidth_conv_sw_4/S_AXIS]
connect_bd_intf_net [get_bd_intf_pins axis_broadcaster_1r15/M01_AXIS] [get_bd_intf_pins axis_dwidth_conv_sw_5/S_AXIS]
connect_bd_intf_net [get_bd_intf_pins scurve_adder_0/s_axi_CTRL_BUS] [get_bd_intf_pins inst_interconnect_100MHz/M04_AXI]
connect_bd_intf_net [get_bd_intf_pins axis_data_fifo_sa_00/M_AXIS] [get_bd_intf_pins scurve_adder_0/in_stream0]
connect_bd_intf_net [get_bd_intf_pins axis_data_fifo_sa_01/M_AXIS] [get_bd_intf_pins scurve_adder_0/in_stream1]
connect_bd_intf_net [get_bd_intf_pins axis_data_fifo_sa_02/M_AXIS] [get_bd_intf_pins scurve_adder_0/in_stream2]
connect_bd_intf_net [get_bd_intf_pins axis_data_fifo_sa_03/M_AXIS] [get_bd_intf_pins scurve_adder_0/in_stream3]
connect_bd_intf_net [get_bd_intf_pins axis_data_fifo_sa_04/M_AXIS] [get_bd_intf_pins scurve_adder_0/in_stream4]
connect_bd_intf_net [get_bd_intf_pins axis_data_fifo_sa_05/M_AXIS] [get_bd_intf_pins scurve_adder_0/in_stream5]
connect_bd_intf_net [get_bd_intf_pins axis_broadcaster_1r/M01_AXIS] [get_bd_intf_pins axis_data_fifo_L2/S_AXIS]
connect_bd_intf_net [get_bd_intf_pins axi_dma_L2/M_AXI_S2MM] [get_bd_intf_pins axi_interconnect_DMA_INT/S00_AXI]
connect_bd_intf_net [get_bd_intf_pins axis_data_fifo_L2/M_AXIS] [get_bd_intf_pins l2_trigger_0/in_stream]
connect_bd_intf_net [get_bd_intf_pins inst_interconnect_100MHz/M01_AXI] [get_bd_intf_pins l2_trigger_0/s_axi_CTRL_BUS]
connect_bd_intf_net [get_bd_intf_pins l2_trigger_0/out_stream] [get_bd_intf_pins axis_data_fifo_fc_L2b/S_AXIS]
connect_bd_intf_net -intf_net axis_flow_control_L2_m_axis [get_bd_intf_pins axi_dma_L1/S_AXIS_S2MM] [get_bd_intf_pins axis_flow_control_D2/m_axis]
connect_bd_intf_net [get_bd_intf_pins axis_broadcaster_01/M01_AXIS] [get_bd_intf_pins axis_clock_converter_1/S_AXIS]
connect_bd_intf_net [get_bd_intf_pins axis_broadcaster_02/M01_AXIS] [get_bd_intf_pins axis_clock_converter_5/S_AXIS]
connect_bd_intf_net [get_bd_intf_pins axis_broadcaster_03/M01_AXIS] [get_bd_intf_pins axis_clock_converter_4/S_AXIS]
connect_bd_intf_net [get_bd_intf_pins axis_broadcaster_04/M01_AXIS] [get_bd_intf_pins axis_clock_converter_2/S_AXIS]
connect_bd_intf_net [get_bd_intf_pins axis_broadcaster_05/M01_AXIS] [get_bd_intf_pins axis_clock_converter_3/S_AXIS]
connect_bd_intf_net -intf_net axis_data_fifo_1_M_AXIS [get_bd_intf_pins axis_broadcaster_01/S_AXIS] [get_bd_intf_pins axis_data_1st_fifo_1/M_AXIS]
connect_bd_intf_net [get_bd_intf_pins axis_data_1st_fifo_1/S_AXIS] [get_bd_intf_pins axi_data_provider_0/m_axis_art0r]
connect_bd_intf_net -intf_net axis_data_fifo_2_M_AXIS [get_bd_intf_pins axis_broadcaster_02/S_AXIS] [get_bd_intf_pins axis_data_1st_fifo_2/M_AXIS]
connect_bd_intf_net [get_bd_intf_pins axis_data_1st_fifo_2/S_AXIS] [get_bd_intf_pins axi_data_provider_0/m_axis_art1l]
connect_bd_intf_net -intf_net axis_data_fifo_3_M_AXIS [get_bd_intf_pins axis_broadcaster_03/S_AXIS] [get_bd_intf_pins axis_data_1st_fifo_3/M_AXIS]
connect_bd_intf_net [get_bd_intf_pins axis_data_1st_fifo_3/S_AXIS] [get_bd_intf_pins axi_data_provider_0/m_axis_art1r]
connect_bd_intf_net -intf_net axis_data_fifo_4_M_AXIS [get_bd_intf_pins axis_broadcaster_04/S_AXIS] [get_bd_intf_pins axis_data_1st_fifo_4/M_AXIS]
connect_bd_intf_net [get_bd_intf_pins axis_data_1st_fifo_4/S_AXIS] [get_bd_intf_pins axi_data_provider_0/m_axis_art2l]
connect_bd_intf_net -intf_net axis_data_fifo_5_M_AXIS [get_bd_intf_pins axis_broadcaster_05/S_AXIS] [get_bd_intf_pins axis_data_1st_fifo_5/M_AXIS]
connect_bd_intf_net [get_bd_intf_pins axis_data_1st_fifo_5/S_AXIS] [get_bd_intf_pins axi_data_provider_0/m_axis_art2r]
connect_bd_intf_net -intf_net axis_flow_control_d1_0_m_axis [get_bd_intf_pins axi_dma_raw/S_AXIS_S2MM] [get_bd_intf_pins axis_flow_control_D1/m_axis]
connect_bd_intf_net [get_bd_intf_pins axis_flow_control_D1/S_AXI] [get_bd_intf_pins inst_interconnect_200MHz/M03_AXI]
connect_bd_intf_net [get_bd_intf_pins top_switch_raw/m_axis] [get_bd_intf_pins axis_flow_control_D1/s_axis]
connect_bd_intf_net [get_bd_intf_pins axi_gps_core_0/S_AXI] [get_bd_intf_pins inst_interconnect_100MHz/M10_AXI]
connect_bd_intf_net [get_bd_intf_pins axi_fifo_mm_s_TA_ev/S_AXI] [get_bd_intf_pins inst_interconnect_200MHz/M05_AXI]
connect_bd_intf_net [get_bd_intf_pins inst_interconnect_200MHz/M06_AXI] [get_bd_intf_pins axi_gpio_TA_ev/S_AXI]
connect_bd_intf_net [get_bd_intf_pins ALGO_B_TA_1/m_ev_axis] [get_bd_intf_pins axis_flow_control_D1/s_axis_ta_event]
connect_bd_intf_net [get_bd_intf_pins inst_interconnect_100MHz/M05_AXI] [get_bd_intf_pins axi_cathode_ctrl_0/S_AXI]
connect_bd_intf_net [get_bd_intf_pins inst_interconnect_100MHz/M14_AXI] [get_bd_intf_pins axi_fifo4adcv/S_AXI]
connect_bd_intf_net -intf_net axis_data_fifo_0_M_AXIS [get_bd_intf_pins axis_data_1st_fifo_0/M_AXIS] [get_bd_intf_pins axis_broadcaster_00/S_AXIS]
connect_bd_intf_net [get_bd_intf_pins axis_broadcaster_00/M01_AXIS] [get_bd_intf_pins axis_clock_converter_0/S_AXIS]
connect_bd_intf_net [get_bd_intf_pins axis_data_1st_fifo_0/S_AXIS] [get_bd_intf_pins axi_data_provider_0/m_axis_art0l]
connect_bd_intf_net [get_bd_intf_pins axis_clock_converter_0/M_AXIS] [get_bd_intf_pins axis_dwidth_converter_0/S_AXIS]
connect_bd_intf_net -intf_net axis_broadcaster_1r1_M00_AXIS [get_bd_intf_pins axis_broadcaster_00/M00_AXIS] [get_bd_intf_pins axis_data_fifo_sa_00/S_AXIS]
connect_bd_intf_net [get_bd_intf_pins axis_dwidth_converter_0/M_AXIS] [get_bd_intf_pins axis_broadcaster_1r10/S_AXIS]
connect_bd_intf_net [get_bd_intf_pins axis_broadcaster_1r10/M00_AXIS] [get_bd_intf_pins axi_pixel_mask_0/S00_AXIS]
connect_bd_intf_net [get_bd_intf_pins axi_pixel_mask_0/M00_AXIS] [get_bd_intf_pins ALGO_B_0/S00_AXIS]
connect_bd_intf_net [get_bd_intf_pins ALGO_B_0/S01_AXIS] [get_bd_intf_pins axi_pixel_mask_0/M01_AXIS]
connect_bd_intf_net [get_bd_intf_pins axi_pixel_mask_0/S01_AXIS] [get_bd_intf_pins axis_broadcaster_1r11/M00_AXIS]
connect_bd_intf_net [get_bd_intf_pins axis_broadcaster_1r12/M00_AXIS] [get_bd_intf_pins axi_pixel_mask_0/S02_AXIS]
connect_bd_intf_net [get_bd_intf_pins axi_pixel_mask_0/M02_AXIS] [get_bd_intf_pins ALGO_B_2/S01_AXIS]
connect_bd_intf_net [get_bd_intf_pins ALGO_B_2/S00_AXIS] [get_bd_intf_pins axi_pixel_mask_0/M03_AXIS]
connect_bd_intf_net [get_bd_intf_pins axis_broadcaster_1r13/M00_AXIS] [get_bd_intf_pins axi_pixel_mask_0/S03_AXIS]
connect_bd_intf_net [get_bd_intf_pins axis_broadcaster_1r14/M00_AXIS] [get_bd_intf_pins axi_pixel_mask_0/S04_AXIS]
connect_bd_intf_net [get_bd_intf_pins axi_pixel_mask_0/M04_AXIS] [get_bd_intf_pins ALGO_B_1/S00_AXIS]
connect_bd_intf_net [get_bd_intf_pins axis_broadcaster_1r15/M00_AXIS] [get_bd_intf_pins axi_pixel_mask_0/S05_AXIS]
connect_bd_intf_net [get_bd_intf_pins axi_pixel_mask_0/M05_AXIS] [get_bd_intf_pins ALGO_B_1/S01_AXIS]
connect_bd_intf_net [get_bd_intf_pins axi_pixel_mask_0/S_AXI] [get_bd_intf_pins inst_interconnect_200MHz/M01_AXI]
connect_bd_intf_net [get_bd_intf_pins axi_timer_0/S_AXI] [get_bd_intf_pins inst_interconnect_200MHz/M04_AXI]
connect_bd_intf_net [get_bd_intf_pins axis_dwidth_converter_7/M_AXIS] [get_bd_intf_pins axi_fifo4adcv/AXI_STR_RXD]
connect_bd_intf_net [get_bd_intf_pins axi_cathode_ctrl_0/axis_cathode] [get_bd_intf_pins axis_dwidth_converter_7/S_AXIS]
connect_bd_intf_net [get_bd_intf_ports DDR] [get_bd_intf_pins processing_system7_0/DDR]
connect_bd_intf_net [get_bd_intf_ports FIXED_IO] [get_bd_intf_pins processing_system7_0/FIXED_IO]
connect_bd_intf_net [get_bd_intf_ports artx_initb_io] [get_bd_intf_pins axi_artix_conf_v1_0_0/artx_initb_io]
connect_bd_intf_net [get_bd_intf_ports artx_programb_io] [get_bd_intf_pins axi_artix_conf_v1_0_0/artx_programb_io]
connect_bd_intf_net -intf_net clk_art_1_1 [get_bd_intf_ports clk_art_1] [get_bd_intf_pins clk_wiz_1/CLK_IN1_D]
connect_bd_intf_net [get_bd_intf_ports clk_art_0] [get_bd_intf_pins clk_wiz_0/CLK_IN1_D]
connect_bd_intf_net -intf_net CLK_IN1_D_1_2 [get_bd_intf_ports clk_art_2] [get_bd_intf_pins clk_wiz_2/CLK_IN1_D]
connect_bd_net [get_bd_pins processing_system7_0/FCLK_CLK1] \
  [get_bd_pins axi_artix_conf_v1_0_0/s00_axi_aclk] [get_bd_pins axi_gpio_0/s_axi_aclk] \
  [get_bd_pins axi_quad_spi_0/ext_spi_clk] [get_bd_pins axi_quad_spi_0/s_axi_aclk] \
  [get_bd_pins rst_processing_system7_0_100M/slowest_sync_clk] [get_bd_pins axi_fifo_mm_s_1/s_axi_aclk] \
  [get_bd_pins axis_dwidth_converter_1/aclk] [get_bd_pins spaciroc3_sc_0/s00_axis_aclk] \
  [get_bd_pins spaciroc3_sc_0/s00_axi_aclk] [get_bd_pins axi_dma_L1/s_axi_lite_aclk] [get_bd_pins axi_dma_L1/m_axi_s2mm_aclk] \
  [get_bd_pins axis_broadcaster_1r/aclk] [get_bd_pins axis_data_fifo_L2/s_axis_aclk] \
  [get_bd_pins axis_data_fifo_fc_L2b/s_axis_aclk] [get_bd_pins scurve_adder_0/ap_clk] \
  [get_bd_pins axi_dma_L2/s_axi_lite_aclk] [get_bd_pins axi_dma_L2/m_axi_s2mm_aclk] [get_bd_pins axis_broadcaster_05/aclk] \
  [get_bd_pins axis_broadcaster_04/aclk] [get_bd_pins axis_broadcaster_03/aclk] [get_bd_pins axis_broadcaster_02/aclk] \
  [get_bd_pins axis_broadcaster_00/aclk] [get_bd_pins axis_broadcaster_01/aclk] \
  [get_bd_pins axis_data_fifo_sa_01/s_axis_aclk] [get_bd_pins axis_clock_converter_1/s_axis_aclk] \
  [get_bd_pins axis_clock_converter_0/s_axis_aclk] [get_bd_pins axis_data_fifo_sa_02/s_axis_aclk] \
  [get_bd_pins axis_clock_converter_5/s_axis_aclk] [get_bd_pins axis_clock_converter_4/s_axis_aclk] \
  [get_bd_pins axis_data_fifo_sa_03/s_axis_aclk] [get_bd_pins axis_clock_converter_2/s_axis_aclk] \
  [get_bd_pins axis_data_fifo_sa_04/s_axis_aclk] [get_bd_pins axis_data_fifo_sa_05/s_axis_aclk] \
  [get_bd_pins axis_clock_converter_3/s_axis_aclk] [get_bd_pins processing_system7_0/M_AXI_GP1_ACLK] \
  [get_bd_pins processing_system7_0/S_AXI_HP1_ACLK] [get_bd_pins axis_data_fifo_sa_00/s_axis_aclk] \
  [get_bd_pins axis_data_1st_fifo_5/s_axis_aclk] [get_bd_pins axis_data_1st_fifo_4/s_axis_aclk] \
  [get_bd_pins axis_data_1st_fifo_3/s_axis_aclk] [get_bd_pins axis_data_1st_fifo_2/s_axis_aclk] \
  [get_bd_pins axis_data_1st_fifo_1/s_axis_aclk] [get_bd_pins axis_data_1st_fifo_0/s_axis_aclk] \
  [get_bd_pins l2_trigger_0/ap_clk] [get_bd_pins axi_fifo4adcv/s_axi_aclk] [get_bd_pins axi_data_provider_0/m_axis_aclk] \
  [get_bd_pins axi_data_provider_0/s00_axi_aclk] [get_bd_pins axi_gps_core_0/S_AXI_ACLK] \
  [get_bd_pins axis_flow_control_D2/s_axis_aclk] [get_bd_pins axis_flow_control_D2/S_AXI_ACLK] \
  [get_bd_pins hv_hk_v1_0_0/s00_axi_aclk] [get_bd_pins axi_cathode_ctrl_0/S_AXI_ACLK] \
  [get_bd_pins axis_dwidth_converter_7/aclk] [get_bd_pins inst_interconnect_100MHz/ACLK] \
  [get_bd_pins inst_interconnect_100MHz/S00_ACLK] [get_bd_pins inst_interconnect_100MHz/M00_ACLK] \
  [get_bd_pins inst_interconnect_100MHz/M01_ACLK] [get_bd_pins inst_interconnect_100MHz/M02_ACLK] \
  [get_bd_pins inst_interconnect_100MHz/M03_ACLK] [get_bd_pins inst_interconnect_100MHz/M04_ACLK] \
  [get_bd_pins inst_interconnect_100MHz/M05_ACLK] [get_bd_pins inst_interconnect_100MHz/M06_ACLK] \
  [get_bd_pins inst_interconnect_100MHz/M07_ACLK] [get_bd_pins inst_interconnect_100MHz/M08_ACLK] \
  [get_bd_pins inst_interconnect_100MHz/M09_ACLK] [get_bd_pins axi_interconnect_DMA_INT/ACLK] \
  [get_bd_pins axi_interconnect_DMA_INT/S00_ACLK] [get_bd_pins axi_interconnect_DMA_INT/M00_ACLK] \
  [get_bd_pins axi_interconnect_DMA_INT/S01_ACLK] [get_bd_pins inst_interconnect_100MHz/M10_ACLK] \
  [get_bd_pins inst_interconnect_100MHz/M11_ACLK] [get_bd_pins inst_interconnect_100MHz/M12_ACLK] \
  [get_bd_pins inst_interconnect_100MHz/M13_ACLK] [get_bd_pins inst_interconnect_100MHz/M14_ACLK]
connect_bd_net [get_bd_pins processing_system7_0/FCLK_RESET0_N] \
  [get_bd_pins rst_processing_system7_0_100M/ext_reset_in] [get_bd_pins rst_processing_system7_0_200M/ext_reset_in]
connect_bd_net -net rst_processing_system7_0_50M_peripheral_aresetn [get_bd_pins rst_processing_system7_0_100M/peripheral_aresetn] \
  [get_bd_pins axi_artix_conf_v1_0_0/s00_axi_aresetn] [get_bd_pins axi_gpio_0/s_axi_aresetn] \
  [get_bd_pins axi_quad_spi_0/s_axi_aresetn] [get_bd_pins axi_fifo_mm_s_1/s_axi_aresetn] \
  [get_bd_pins axis_dwidth_converter_1/aresetn] [get_bd_pins spaciroc3_sc_0/s00_axis_aresetn] \
  [get_bd_pins spaciroc3_sc_0/s00_axi_aresetn] [get_bd_pins axi_dma_L1/axi_resetn] [get_bd_pins axis_broadcaster_1r/aresetn] \
  [get_bd_pins axis_data_fifo_fc_L2b/s_axis_aresetn] [get_bd_pins axis_data_fifo_L2/s_axis_aresetn] \
  [get_bd_pins scurve_adder_0/ap_rst_n] [get_bd_pins axis_broadcaster_03/aresetn] [get_bd_pins axis_broadcaster_05/aresetn] \
  [get_bd_pins axis_broadcaster_02/aresetn] [get_bd_pins axis_broadcaster_01/aresetn] \
  [get_bd_pins axis_broadcaster_04/aresetn] [get_bd_pins axis_broadcaster_00/aresetn] \
  [get_bd_pins axis_data_fifo_sa_03/s_axis_aresetn] [get_bd_pins axis_data_fifo_sa_01/s_axis_aresetn] \
  [get_bd_pins axis_data_fifo_sa_04/s_axis_aresetn] [get_bd_pins axis_data_fifo_sa_02/s_axis_aresetn] \
  [get_bd_pins axis_data_fifo_sa_05/s_axis_aresetn] [get_bd_pins axis_data_fifo_sa_00/s_axis_aresetn] \
  [get_bd_pins axis_clock_converter_5/s_axis_aresetn] [get_bd_pins axis_clock_converter_4/s_axis_aresetn] \
  [get_bd_pins axis_clock_converter_3/s_axis_aresetn] [get_bd_pins axis_clock_converter_2/s_axis_aresetn] \
  [get_bd_pins axis_clock_converter_1/s_axis_aresetn] [get_bd_pins axis_clock_converter_0/s_axis_aresetn] \
  [get_bd_pins axis_data_1st_fifo_5/s_axis_aresetn] [get_bd_pins axis_data_1st_fifo_4/s_axis_aresetn] \
  [get_bd_pins axis_data_1st_fifo_3/s_axis_aresetn] [get_bd_pins axis_data_1st_fifo_2/s_axis_aresetn] \
  [get_bd_pins axis_data_1st_fifo_1/s_axis_aresetn] [get_bd_pins axis_data_1st_fifo_0/s_axis_aresetn] \
  [get_bd_pins l2_trigger_0/ap_rst_n] [get_bd_pins axi_fifo4adcv/s_axi_aresetn] \
  [get_bd_pins axi_data_provider_0/s00_axi_aresetn] [get_bd_pins axi_gps_core_0/S_AXI_ARESETN] \
  [get_bd_pins axis_flow_control_D2/s_axis_aresetn] [get_bd_pins axis_flow_control_D2/S_AXI_ARESETN] \
  [get_bd_pins hv_hk_v1_0_0/s00_axi_aresetn] [get_bd_pins axi_cathode_ctrl_0/S_AXI_ARESETN] \
  [get_bd_pins axis_dwidth_converter_7/aresetn] [get_bd_pins inst_interconnect_100MHz/S00_ARESETN] \
  [get_bd_pins inst_interconnect_100MHz/M00_ARESETN] [get_bd_pins inst_interconnect_100MHz/M01_ARESETN] \
  [get_bd_pins inst_interconnect_100MHz/M02_ARESETN] [get_bd_pins inst_interconnect_100MHz/M03_ARESETN] \
  [get_bd_pins inst_interconnect_100MHz/M04_ARESETN] [get_bd_pins inst_interconnect_100MHz/M05_ARESETN] \
  [get_bd_pins inst_interconnect_100MHz/M06_ARESETN] [get_bd_pins inst_interconnect_100MHz/M07_ARESETN] \
  [get_bd_pins inst_interconnect_100MHz/M08_ARESETN] [get_bd_pins inst_interconnect_100MHz/M09_ARESETN] \
  [get_bd_pins axi_interconnect_DMA_INT/S00_ARESETN] [get_bd_pins axi_interconnect_DMA_INT/M00_ARESETN] \
  [get_bd_pins axi_interconnect_DMA_INT/S01_ARESETN] [get_bd_pins inst_interconnect_100MHz/M10_ARESETN] \
  [get_bd_pins inst_interconnect_100MHz/M11_ARESETN] [get_bd_pins inst_interconnect_100MHz/M12_ARESETN] \
  [get_bd_pins inst_interconnect_100MHz/M13_ARESETN] [get_bd_pins inst_interconnect_100MHz/M14_ARESETN]
connect_bd_net -net rst_processing_system7_0_50M_interconnect_aresetn [get_bd_pins rst_processing_system7_0_100M/interconnect_aresetn] \
  [get_bd_pins inst_interconnect_100MHz/ARESETN] [get_bd_pins axi_interconnect_DMA_INT/ARESETN]
connect_bd_net [get_bd_ports artx_done] [get_bd_pins axi_artix_conf_v1_0_0/artx_done]
connect_bd_net [get_bd_pins axi_quad_spi_0/io0_o] [get_bd_ports artx_conf_data]
connect_bd_net [get_bd_pins axi_quad_spi_0/sck_o] [get_bd_ports artx_conf_cclk]
connect_bd_net [get_bd_pins xlconcat_0/dout] [get_bd_pins axi_gpio_0/gpio_io_i]
connect_bd_net -net frame_art1_1 [get_bd_ports frame_art1] [get_bd_pins axi_data_provider_0/frame_art1]
connect_bd_net -net data_art1_1 [get_bd_ports data_art1] [get_bd_pins axi_data_provider_0/data_art1]
connect_bd_net [get_bd_pins spaciroc3_sc_0/sr_ck_pc] [get_bd_ports sr_ck_pc] [get_bd_ports sr_ck_pc_art]
connect_bd_net [get_bd_pins spaciroc3_sc_0/sr_rstb_pc] [get_bd_ports sr_rstb_pc]
connect_bd_net [get_bd_pins spaciroc3_sc_0/select_sc_probe_pc] [get_bd_ports select_sc_probe_pc]
connect_bd_net [get_bd_pins spaciroc3_sc_0/resetb_pc] [get_bd_ports resetb_pc]
connect_bd_net [get_bd_pins spaciroc3_sc_0/select_din_pc] [get_bd_ports select_din_pc]
connect_bd_net [get_bd_pins spaciroc3_sc_0/loadb_sc_pc] [get_bd_ports loadb_sc_pc]
connect_bd_net [get_bd_pins spaciroc3_sc_0/sr_in_pc] [get_bd_ports sr_in_pc]
connect_bd_net [get_bd_pins hv_hk_v1_0_0/sck_p] [get_bd_ports sck_p]
connect_bd_net [get_bd_pins hv_hk_v1_0_0/sck_n] [get_bd_ports sck_n]
connect_bd_net [get_bd_pins hv_hk_v1_0_0/mosi_p] [get_bd_ports mosi_p]
connect_bd_net [get_bd_pins hv_hk_v1_0_0/mosi_n] [get_bd_ports mosi_n]
connect_bd_net [get_bd_pins hv_hk_v1_0_0/cs_exp_p] [get_bd_ports cs_exp_p]
connect_bd_net [get_bd_pins hv_hk_v1_0_0/cs_exp_n] [get_bd_ports cs_exp_n]
connect_bd_net [get_bd_pins hv_hk_v1_0_0/cs_dac_p] [get_bd_ports cs_dac_p]
connect_bd_net [get_bd_pins hv_hk_v1_0_0/cs_dac_n] [get_bd_ports cs_dac_n]
connect_bd_net [get_bd_ports miso_p] [get_bd_pins hv_hk_v1_0_0/miso_p]
connect_bd_net [get_bd_ports miso_n] [get_bd_pins hv_hk_v1_0_0/miso_n]
connect_bd_net [get_bd_ports intr_p] [get_bd_pins hv_hk_v1_0_0/intr_p]
connect_bd_net [get_bd_ports intr_n] [get_bd_pins hv_hk_v1_0_0/intr_n]
connect_bd_net -net frame_art0_1 [get_bd_ports frame_art0] [get_bd_pins axi_data_provider_0/frame_art0]
connect_bd_net -net frame_art2_1 [get_bd_ports frame_art2] [get_bd_pins axi_data_provider_0/frame_art2]
connect_bd_net -net data_art0_1 [get_bd_ports data_art0] [get_bd_pins axi_data_provider_0/data_art0]
connect_bd_net -net data_art2_1 [get_bd_ports data_art2] [get_bd_pins axi_data_provider_0/data_art2]
connect_bd_net [get_bd_pins clk_wiz_0/locked] [get_bd_pins xlconcat_0/In0]
connect_bd_net [get_bd_pins clk_wiz_0/clk_out1] [get_bd_pins axi_data_provider_0/clk_art0_x1]
connect_bd_net [get_bd_pins clk_wiz_2/locked] [get_bd_pins xlconcat_0/In2]
connect_bd_net [get_bd_pins clk_wiz_2/clk_out1] [get_bd_pins axi_data_provider_0/clk_art2_x1]
connect_bd_net [get_bd_pins processing_system7_0/FCLK_CLK0] \
  [get_bd_pins axi_dma_raw/s_axi_lite_aclk] [get_bd_pins axi_dma_raw/m_axi_s2mm_aclk] \
  [get_bd_pins axis_dwidth_converter_3/aclk] [get_bd_pins axis_dwidth_converter_0/aclk] \
  [get_bd_pins axis_dwidth_converter_2/aclk] [get_bd_pins axis_dwidth_converter_6/aclk] \
  [get_bd_pins axis_dwidth_converter_4/aclk] [get_bd_pins axis_dwidth_converter_5/aclk] \
  [get_bd_pins axis_clock_converter_1/m_axis_aclk] [get_bd_pins axis_clock_converter_0/m_axis_aclk] \
  [get_bd_pins axis_clock_converter_5/m_axis_aclk] [get_bd_pins axis_clock_converter_4/m_axis_aclk] \
  [get_bd_pins axis_clock_converter_2/m_axis_aclk] [get_bd_pins axis_clock_converter_3/m_axis_aclk] \
  [get_bd_pins axis_fifo_sw_3/s_axis_aclk] [get_bd_pins axis_fifo_sw_2/s_axis_aclk] [get_bd_pins axis_fifo_sw_0/s_axis_aclk] \
  [get_bd_pins axis_dwidth_conv_sw_0/aclk] [get_bd_pins axis_dwidth_conv_sw_2/aclk] [get_bd_pins axis_dwidth_conv_sw_4/aclk] \
  [get_bd_pins processing_system7_0/M_AXI_GP0_ACLK] [get_bd_pins processing_system7_0/S_AXI_HP0_ACLK] \
  [get_bd_pins rst_processing_system7_0_200M/slowest_sync_clk] [get_bd_pins axis_dwidth_conv_sw_1/aclk] \
  [get_bd_pins axis_dwidth_conv_sw_3/aclk] [get_bd_pins axis_dwidth_conv_sw_5/aclk] [get_bd_pins axis_fifo_sw_5/s_axis_aclk] \
  [get_bd_pins axis_fifo_sw_4/s_axis_aclk] [get_bd_pins axis_fifo_sw_1/s_axis_aclk] [get_bd_pins axis_broadcaster_1r10/aclk] \
  [get_bd_pins axis_broadcaster_1r11/aclk] [get_bd_pins axis_broadcaster_1r12/aclk] [get_bd_pins axis_broadcaster_1r13/aclk] \
  [get_bd_pins axis_broadcaster_1r14/aclk] [get_bd_pins axis_broadcaster_1r15/aclk] [get_bd_pins top_switch_raw/s_axis_aclk] \
  [get_bd_pins top_switch_raw/S_AXI_ACLK] [get_bd_pins axi_fifo_mm_s_TA_ev/s_axi_aclk] \
  [get_bd_pins axi_gpio_TA_ev/s_axi_aclk] [get_bd_pins ALGO_B_0/S00_AXIS_ACLK] [get_bd_pins ALGO_B_0/S01_AXIS_ACLK] \
  [get_bd_pins ALGO_B_1/S00_AXIS_ACLK] [get_bd_pins ALGO_B_1/S01_AXIS_ACLK] [get_bd_pins ALGO_B_2/S00_AXIS_ACLK] \
  [get_bd_pins ALGO_B_2/S01_AXIS_ACLK] [get_bd_pins ALGO_B_TA_1/CLOCK_200] [get_bd_pins ALGO_B_TA_1/m_axis_aclk] \
  [get_bd_pins axi_pixel_mask_0/S_AXI_ACLK] [get_bd_pins axi_timer_0/s_axi_aclk] [get_bd_pins axi_interconnect_DMA_RAW/ACLK] \
  [get_bd_pins axi_interconnect_DMA_RAW/S00_ACLK] [get_bd_pins axi_interconnect_DMA_RAW/M00_ACLK] \
  [get_bd_pins inst_interconnect_200MHz/M02_ACLK] [get_bd_pins inst_interconnect_200MHz/M01_ACLK] \
  [get_bd_pins inst_interconnect_200MHz/M00_ACLK] [get_bd_pins inst_interconnect_200MHz/S00_ACLK] \
  [get_bd_pins inst_interconnect_200MHz/ACLK] [get_bd_pins inst_interconnect_200MHz/M03_ACLK] \
  [get_bd_pins inst_interconnect_200MHz/M04_ACLK] [get_bd_pins inst_interconnect_200MHz/M05_ACLK] \
  [get_bd_pins inst_interconnect_200MHz/M06_ACLK] [get_bd_pins axis_flow_control_D1/s_axis_aclk] \
  [get_bd_pins axis_flow_control_D1/S_AXI_ACLK]
connect_bd_net -net axis_data_fifo_fc_L9_axis_data_count [get_bd_pins axis_fifo_sw_0/axis_data_count] [get_bd_pins top_switch_raw/gpio_0]
connect_bd_net -net axis_data_fifo_fc_L11_axis_data_count [get_bd_pins axis_fifo_sw_3/axis_data_count] [get_bd_pins top_switch_raw/gpio_1]
connect_bd_net -net axis_data_fifo_fc_L10_axis_data_count [get_bd_pins axis_fifo_sw_2/axis_data_count] [get_bd_pins top_switch_raw/gpio_2]
connect_bd_net [get_bd_pins xlslice_0/Dout] \
  [get_bd_pins axis_flow_control_D2/trig0] [get_bd_pins axis_flow_control_D2/trig1] [get_bd_pins axis_flow_control_D2/trig2]
connect_bd_net -net clk_wiz_3_locked [get_bd_pins clk_wiz_1/locked] [get_bd_pins xlconcat_0/In1]
connect_bd_net -net clk_wiz_3_clk_out1 [get_bd_pins clk_wiz_1/clk_out1] [get_bd_pins axi_data_provider_0/clk_art1_x1]
connect_bd_net -net ARESETN_1 [get_bd_pins rst_processing_system7_0_200M/interconnect_aresetn] \
  [get_bd_pins inst_interconnect_200MHz/ARESETN] [get_bd_pins axi_interconnect_DMA_RAW/ARESETN]
